# Altium project EPS.PrjPcb (part 3 of 4)

## Sheet EPS_MPPT_Y_OR_MPB.SchDoc: MPPT-Y / MPB ORing
size A4; ApprovedBy: (not approved); CheckedBy: (not checked); Author: Piotr Kuligowski; DocumentNumber: PWSat2-xxx-DW-xxx; Revision: 2; SheetNumber: 23; SheetTotal: 51; Model: EM2
Used 2 times, as channels Top/MPPT Y+/MPPTY ORing to MPB, Top/MPPT Y-/MPPTY ORing to MPB. Parts and nets are listed once, with the designators drawn on the sheet.
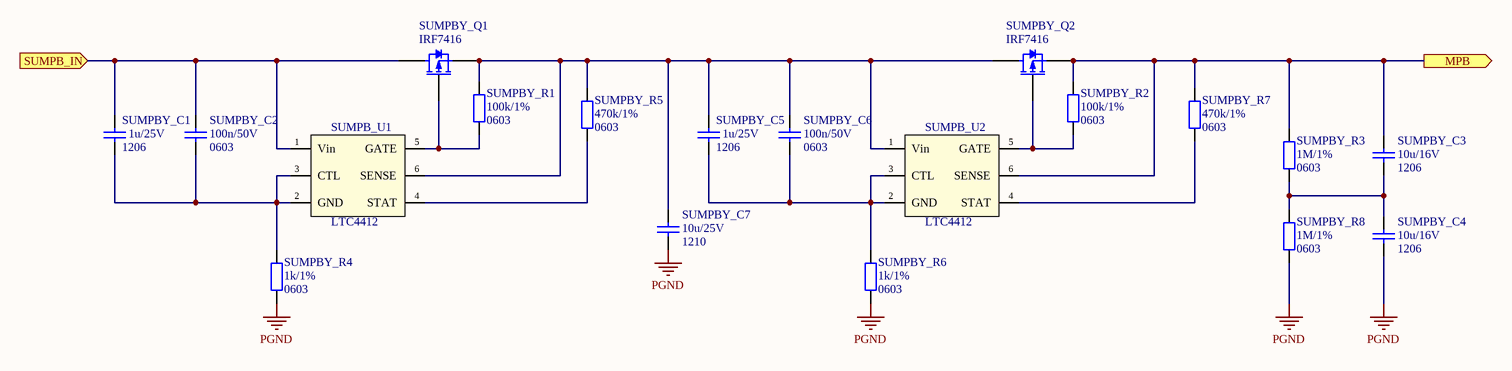
[diagram p23: EPS_MPPT_Y_OR_MPB.SchDoc]

### Parts
SUMPB_U1  LTC4412  [SOT23-6]
SUMPB_U2  LTC4412  [SOT23-6]
SUMPBY_C1  Package: 1206  [SMD_Capacitor_1206]  (hidden comment: 1u/25V)
SUMPBY_C2  Package: 0603  [SMD_Capacitor_0603]  (hidden comment: 100n/50V)
SUMPBY_C3  Packge: 1206  [SMD_Capacitor_1206]  (hidden comment: 10u/16V)
SUMPBY_C4  Packge: 1206  [SMD_Capacitor_1206]  (hidden comment: 10u/16V)
SUMPBY_C5  Package: 1206  [SMD_Capacitor_1206]  (hidden comment: 1u/25V)
SUMPBY_C6  Package: 0603  [SMD_Capacitor_0603]  (hidden comment: 100n/50V)
SUMPBY_C7  Package: 1210  [SMD_Capacitor_1210]  (hidden comment: 10u/25V)
SUMPBY_Q1  IRF7416  [SOIC-8-N_SSSGDDDD]
SUMPBY_Q2  IRF7416  [SOIC-8-N_SSSGDDDD]
SUMPBY_R1  Package: 0603  [SMD_Resistor_0603]  (hidden comment: 100k/1%)
SUMPBY_R2  Package: 0603  [SMD_Resistor_0603]  (hidden comment: 100k/1%)
SUMPBY_R3  Package: 0603  [SMD_Resistor_0603]  (hidden comment: 1M/1%)
SUMPBY_R4  Package: 0603  [SMD_Resistor_0603]  (hidden comment: 1k/1%)
SUMPBY_R5  Package: 0603  [SMD_Resistor_0603]  (hidden comment: 470k/1%)
SUMPBY_R6  Package: 0603  [SMD_Resistor_0603]  (hidden comment: 1k/1%)
SUMPBY_R7  Package: 0603  [SMD_Resistor_0603]  (hidden comment: 470k/1%)
SUMPBY_R8  Package: 0603  [SMD_Resistor_0603]  (hidden comment: 1M/1%)

### Ports
MPB (out), SUMPB_IN (in)

### Nets
PGND: SUMPBY_C4.2 SUMPBY_C7.2 SUMPBY_R4.2 SUMPBY_R6.2 SUMPBY_R8.2
MPB: SUMPB_U2.6(SENSE) SUMPBY_C3.1 SUMPBY_Q2.S SUMPBY_R2.1 SUMPBY_R3.1 SUMPBY_R7.1 ; port MPB
SUMPB_IN: SUMPB_U1.1(Vin) SUMPBY_C1.1 SUMPBY_C2.1 SUMPBY_Q1.D ; port SUMPB_IN
NetSUMPB_U1_2: SUMPB_U1.2(GND) SUMPB_U1.3(CTL) SUMPBY_C1.2 SUMPBY_C2.2 SUMPBY_R4.1
NetSUMPB_U1_4: SUMPB_U1.4(STAT) SUMPBY_R5.2
NetSUMPB_U1_5: SUMPB_U1.5(GATE) SUMPBY_Q1.G SUMPBY_R1.2
NetSUMPB_U1_6: SUMPB_U1.6(SENSE) SUMPB_U2.1(Vin) SUMPBY_C5.1 SUMPBY_C6.1 SUMPBY_C7.1 SUMPBY_Q1.S SUMPBY_Q2.D SUMPBY_R1.1 SUMPBY_R5.1
NetSUMPB_U2_2: SUMPB_U2.2(GND) SUMPB_U2.3(CTL) SUMPBY_C5.2 SUMPBY_C6.2 SUMPBY_R6.1
NetSUMPB_U2_4: SUMPB_U2.4(STAT) SUMPBY_R7.2
NetSUMPB_U2_5: SUMPB_U2.5(GATE) SUMPBY_Q2.G SUMPBY_R2.2
NetSUMPBY_C3_2: SUMPBY_C3.2 SUMPBY_C4.1 SUMPBY_R3.2 SUMPBY_R8.1

### Channels
Top/MPPT Y+/MPPTY ORing to MPB: designators end in _1; ports MPB=NetH3_2 SUMPB_IN=NetMPPT_R13_2_2
Top/MPPT Y-/MPPTY ORing to MPB: designators end in _2; ports MPB=NetH3_2 SUMPB_IN=NetMPPT_R13_3_2

### Notes on the sheet
- Title:
- Project:
- Author:
- Model:
- Document Number:
- Checked by:
- Rev:
- Date:
- Approved by:
- Sheet:
- of
- File name:

### Library data of the parts
SUMPB_U1 SUMPB_U2 = LTC4412: Ideal Diode, Low Loss PowerPath Controller.; Manufacturer: Linear Technology; Value: LTC4412
SUMPBY_C1 SUMPBY_C5 = Cer_C1206T105K3RALTU: Ceramic Cap Kemet COTS 1u/25V X7R 1206; ManufacturerPartNumber: C1206T105K3RALTU; Manufacturer: Kemet; Value: 1u/25V
SUMPBY_C2 SUMPBY_C6 = Cer_GCJ188R71H104KA12D: Ceramic Cap Murata Automotive 100n/50V X7R 0603; Manufacturer: Murata; ManufacturerPartNumber: GCJ188R71H104KA12D; Value: 100n/50V
SUMPBY_C3 SUMPBY_C4 = Cer_C1206T106K4RACTU: Ceramic Cap Kemet COTS 10u/16V X7R 1206; ManufacturerPartNumber: C1206T106K4RACTU; Manufacturer: Kemet; Value: 10u/16V
SUMPBY_C7 = Cer_GCJ32ER71E106KA12L: as DCDCX_C3-DCDCX_C6 on sheet EPS_MPPT_X_Boost-Converter; Manufacturer: Murata; ManufacturerPartNumber: GCJ32ER71E106KA12L; Value: 10u/25V
SUMPBY_Q1 SUMPBY_Q2 = IRF7416: as SUMPBX_Q1 on sheet EPS_MPPT_X_OR_MPB; Value: IRF7416
SUMPBY_R1-SUMPBY_R8 = Res
  SUMPBY_R1 SUMPBY_R2: Value: 100k/1%
  SUMPBY_R3 SUMPBY_R8: Value: 1M/1%
  SUMPBY_R4 SUMPBY_R6: Value: 1k/1%
  SUMPBY_R5 SUMPBY_R7: Value: 470k/1%

## Sheet EPS_RBL.SchDoc: Remove Before Launch
size A4; ApprovedBy: (not approved); CheckedBy: (not checked); Author: Piotr Kuligowski; DocumentNumber: PWSat2-xxx-DW-xxx; Revision: 2; SheetNumber: 32; SheetTotal: 51; Model: EM2
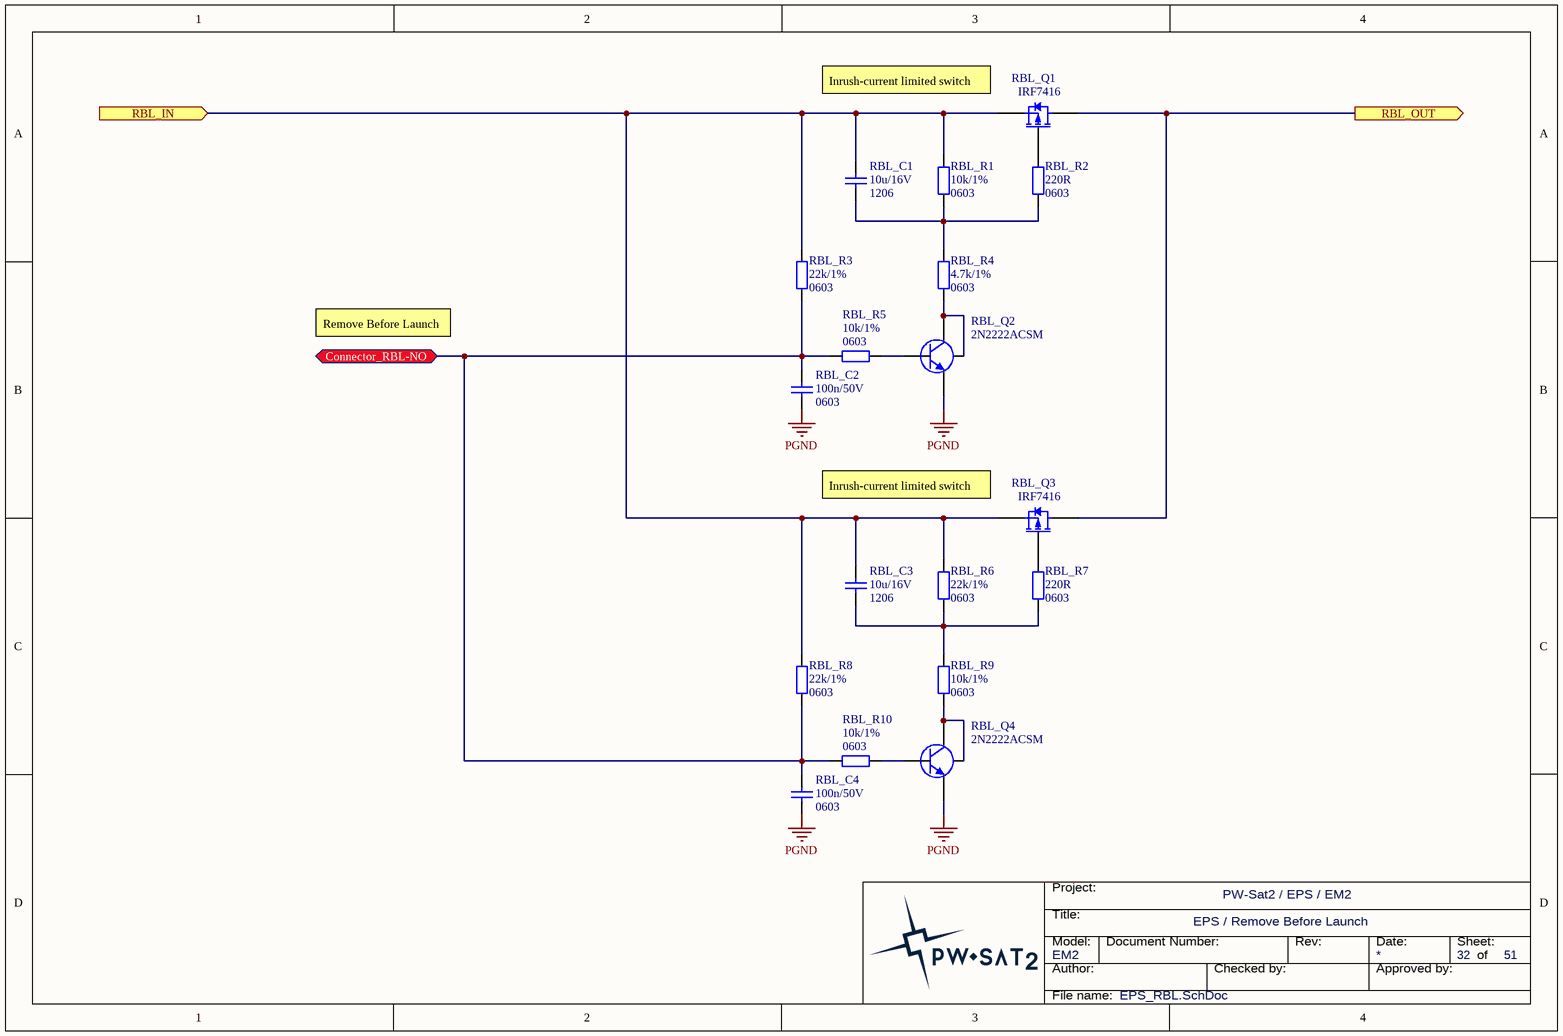
[diagram p24: EPS_RBL.SchDoc]

### Parts
RBL_C1  Packge: 1206  [SMD_Capacitor_1206]  (hidden comment: 10u/16V)
RBL_C2  Package: 0603  [SMD_Capacitor_0603]  (hidden comment: 100n/50V)
RBL_C3  Packge: 1206  [SMD_Capacitor_1206]  (hidden comment: 10u/16V)
RBL_C4  Package: 0603  [SMD_Capacitor_0603]  (hidden comment: 100n/50V)
RBL_Q1  IRF7416  [SOIC-8-N_SSSGDDDD]
RBL_Q2  2N2222ACSM  [LCC1-4_BEC]
RBL_Q3  IRF7416  [SOIC-8-N_SSSGDDDD]
RBL_Q4  2N2222ACSM  [LCC1-4_BEC]
RBL_R1  Package: 0603  [SMD_Resistor_0603]  (hidden comment: 10k/1%)
RBL_R2  Package: 0603  [SMD_Resistor_0603]  (hidden comment: 220R)
RBL_R3  Package: 0603  [SMD_Resistor_0603]  (hidden comment: 22k/1%)
RBL_R4  Package: 0603  [SMD_Resistor_0603]  (hidden comment: 4.7k/1%)
RBL_R5  Package: 0603  [SMD_Resistor_0603]  (hidden comment: 10k/1%)
RBL_R6  Package: 0603  [SMD_Resistor_0603]  (hidden comment: 22k/1%)
RBL_R7  Package: 0603  [SMD_Resistor_0603]  (hidden comment: 220R)
RBL_R8  Package: 0603  [SMD_Resistor_0603]  (hidden comment: 22k/1%)
RBL_R9  Package: 0603  [SMD_Resistor_0603]  (hidden comment: 10k/1%)
RBL_R10  Package: 0603  [SMD_Resistor_0603]  (hidden comment: 10k/1%)

### Ports
Connector_RBL-NO (bidir), RBL_IN (in), RBL_OUT (out)

### Nets
PGND: RBL_C2.2 RBL_C4.2 RBL_Q2.E RBL_Q4.E
NetDRLCL_C1_1_1: RBL_Q1.D RBL_Q3.D ; port RBL_OUT
NetH3_1: RBL_C1.1 RBL_C3.1 RBL_Q1.S RBL_Q3.S RBL_R1.1 RBL_R3.1 RBL_R6.1 RBL_R8.1 ; port RBL_IN
NetH5_2: RBL_C2.1 RBL_C4.1 RBL_R3.2 RBL_R5.1 RBL_R8.2 RBL_R10.1 ; port Connector_RBL-NO
NetRBL_C1_2: RBL_C1.2 RBL_R1.2 RBL_R2.2 RBL_R4.1
NetRBL_C3_2: RBL_C3.2 RBL_R6.2 RBL_R7.2 RBL_R9.1
NetRBL_Q1_G: RBL_Q1.G RBL_R2.1
NetRBL_Q2_B: RBL_Q2.B RBL_R5.2
NetRBL_Q2_C: RBL_Q2.C RBL_Q2.Shield RBL_R4.2
NetRBL_Q3_G: RBL_Q3.G RBL_R7.1
NetRBL_Q4_B: RBL_Q4.B RBL_R10.2
NetRBL_Q4_C: RBL_Q4.C RBL_Q4.Shield RBL_R9.2

### Notes on the sheet
- (near RBL_Q1) Inrush-current limited switch
- Remove Before Launch
- (near RBL_Q3) Inrush-current limited switch
- Title:
- Project:
- Author:
- Model:
- Document Number:
- Checked by:
- Rev:
- Date:
- Approved by:
- Sheet:
- of
- File name:

### Library data of the parts
RBL_C1 RBL_C3 = Cer_C1206T106K4RACTU: Ceramic Cap Kemet COTS 10u/16V X7R 1206; ManufacturerPartNumber: C1206T106K4RACTU; Manufacturer: Kemet; Value: 10u/16V
RBL_C2 RBL_C4 = Cer_GCJ188R71H104KA12D: as SUMPBY_C2 on sheet EPS_MPPT_Y_OR_MPB; Manufacturer: Murata; ManufacturerPartNumber: GCJ188R71H104KA12D; Value: 100n/50V
RBL_Q1 RBL_Q3 = IRF7416: as SUMPBX_Q1 on sheet EPS_MPPT_X_OR_MPB; Value: IRF7416
RBL_Q2 RBL_Q4 = 2N2222ACSM: Silicon Planar Epitaxial NPN Transistor.; Manufacturer: Semelab-TT; Value: 2N2222ACSM
RBL_R1-RBL_R10 = Res
  RBL_R1 RBL_R5 RBL_R9 RBL_R10: Value: 10k/1%
  RBL_R2 RBL_R7: Value: 220R
  RBL_R3 RBL_R6 RBL_R8: Value: 22k/1%
  RBL_R4: Value: 4.7k/1%

## Sheet EPS_DCDC_RLCLs.SchDoc: DCDC / RLCLs
size A4; ApprovedBy: (not approved); CheckedBy: (not checked); Author: Piotr Kuligowski; DocumentNumber: PWSat2-xxx-DW-xxx; Revision: 2; SheetNumber: 36; SheetTotal: 51; Model: EM2
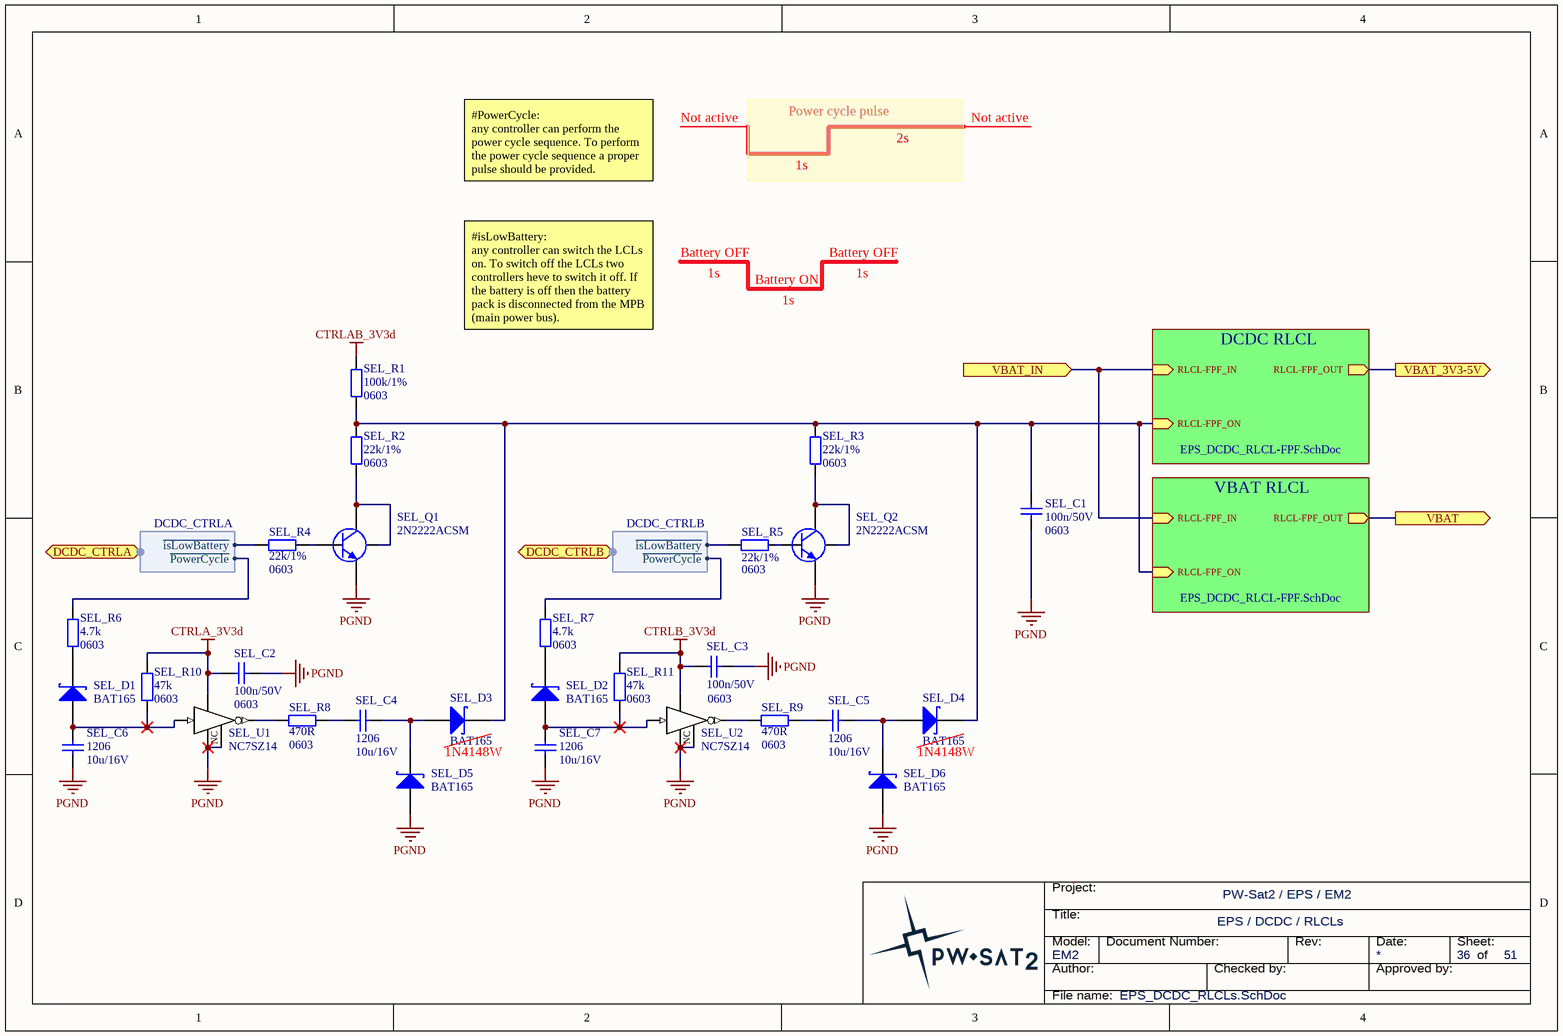
[diagram p25: EPS_DCDC_RLCLs.SchDoc]

### Parts
SEL_C1  value 100n/50V  Package: 0603  [SMD_Capacitor_0603]  (hidden comment: Cap)
SEL_C2  Package: 0603  [SMD_Capacitor_0603]  (hidden comment: 100n/50V)
SEL_C3  Package: 0603  [SMD_Capacitor_0603]  (hidden comment: 100n/50V)
SEL_C4  Packge: 1206  [SMD_Capacitor_1206]  (hidden comment: 10u/16V)
SEL_C5  Packge: 1206  [SMD_Capacitor_1206]  (hidden comment: 10u/16V)
SEL_C6  Packge: 1206  [SMD_Capacitor_1206]  (hidden comment: 10u/16V)
SEL_C7  Packge: 1206  [SMD_Capacitor_1206]  (hidden comment: 10u/16V)
SEL_D1  BAT165  [SOD323]
SEL_D2  BAT165  [SOD323]
SEL_D3  BAT165  [SOD323]
SEL_D4  BAT165  [SOD323]
SEL_D5  BAT165  [SOD323]
SEL_D6  BAT165  [SOD323]
SEL_Q1  2N2222ACSM  [LCC1-4_BEC]
SEL_Q2  2N2222ACSM  [LCC1-4_BEC]
SEL_R1  Package: 0603  [SMD_Resistor_0603]  (hidden comment: 100k/1%)
SEL_R2  Package: 0603  [SMD_Resistor_0603]  (hidden comment: 22k/1%)
SEL_R3  Package: 0603  [SMD_Resistor_0603]  (hidden comment: 22k/1%)
SEL_R4  Package: 0603  [SMD_Resistor_0603]  (hidden comment: 22k/1%)
SEL_R5  Package: 0603  [SMD_Resistor_0603]  (hidden comment: 22k/1%)
SEL_R6  Package: 0603  [SMD_Resistor_0603]  (hidden comment: 4.7k)
SEL_R7  Package: 0603  [SMD_Resistor_0603]  (hidden comment: 4.7k)
SEL_R8  Package: 0603  [SMD_Resistor_0603]  (hidden comment: 470R)
SEL_R9  Package: 0603  [SMD_Resistor_0603]  (hidden comment: 470R)
SEL_R10  Package: 0603  [SMD_Resistor_0603]  (hidden comment: 47k)
SEL_R11  Package: 0603  [SMD_Resistor_0603]  (hidden comment: 47k)
SEL_U1  NC7SZ14  [SOT23-5]
SEL_U2  NC7SZ14  [SOT23-5]

### Sub-sheets
DCDC RLCL = EPS_DCDC_RLCL-FPF.SchDoc: RLCL-FPF_IN (in), RLCL-FPF_OUT (out), RLCL-FPF_ON (in)
VBAT RLCL = EPS_DCDC_RLCL-FPF.SchDoc: RLCL-FPF_IN (in), RLCL-FPF_OUT (out), RLCL-FPF_ON (in)

### Ports
DCDC_CTRLA (harness DCDC_CTRLA), DCDC_CTRLB (harness DCDC_CTRLB), VBAT (out), VBAT_3V3-5V (out), VBAT_IN (in)

### Harnesses
DCDC_CTRLB: ~{PowerCycle}, ~{isLowBattery}
DCDC_CTRLA: ~{PowerCycle}, ~{isLowBattery}

### Nets
CTRLA_3V3d: SEL_C2.1 SEL_R10.2 SEL_U1.5(Vcc)
CTRLAB_3V3d: SEL_R1.2
CTRLB_3V3d: SEL_C3.1 SEL_R11.2 SEL_U2.5(Vcc)
PGND: SEL_C1.2 SEL_C2.2 SEL_C3.2 SEL_C6.1 SEL_C7.1 SEL_D5.A SEL_D6.A SEL_Q1.E SEL_Q2.E SEL_U1.1(NC) SEL_U1.3(GND) SEL_U2.1(NC) SEL_U2.3(GND)
NetCTRLA_U4_14: SEL_R4.1 ; port DCDC_CTRLA.~{isLowBattery}
NetCTRLA_U4_15: SEL_R6.2 ; port DCDC_CTRLA.~{PowerCycle}
NetCTRLB_U1_13: SEL_R5.1 ; port DCDC_CTRLB.~{isLowBattery}
NetCTRLB_U1_14: SEL_R7.2 ; port DCDC_CTRLB.~{PowerCycle}
NetDRLCL_C1_1_1: port VBAT_IN, sheet DCDC RLCL/RLCL-FPF_IN, sheet VBAT RLCL/RLCL-FPF_IN
NetDRLCL_C4_1_1: port VBAT_3V3-5V, sheet DCDC RLCL/RLCL-FPF_OUT
NetDRLCL_C4_2_1: port VBAT, sheet VBAT RLCL/RLCL-FPF_OUT
NetDRLCL_U1_1_4: SEL_C1.1 SEL_D3.K SEL_D4.K SEL_R1.1 SEL_R2.2 SEL_R3.2 ; sheet DCDC RLCL/RLCL-FPF_ON, sheet VBAT RLCL/RLCL-FPF_ON
NetSEL_C4_1: SEL_C4.1 SEL_R8.2
NetSEL_C4_2: SEL_C4.2 SEL_D3.A SEL_D5.K
NetSEL_C5_1: SEL_C5.1 SEL_R9.2
NetSEL_C5_2: SEL_C5.2 SEL_D4.A SEL_D6.K
NetSEL_C6_2: SEL_C6.2 SEL_D1.A SEL_R10.1 SEL_U1.2(A)
NetSEL_C7_2: SEL_C7.2 SEL_D2.A SEL_R11.1 SEL_U2.2(A)
NetSEL_D1_K: SEL_D1.K SEL_R6.1
NetSEL_D2_K: SEL_D2.K SEL_R7.1
NetSEL_Q1_B: SEL_Q1.B SEL_R4.2
NetSEL_Q1_C: SEL_Q1.C SEL_Q1.Shield SEL_R2.1
NetSEL_Q2_B: SEL_Q2.B SEL_R5.2
NetSEL_Q2_C: SEL_Q2.C SEL_Q2.Shield SEL_R3.1
NetSEL_R8_1: SEL_R8.1 SEL_U1.4(Y)
NetSEL_R9_1: SEL_R9.1 SEL_U2.4(Y)

### Notes on the sheet
- Power cycle pulse
- #PowerCycle:
  any controller can perform the power cycle sequence. To perform the power cycle sequence a proper pulse should be provided.
- Not active
- 1s
- 2s
- Battery OFF
- Battery ON
- #isLowBattery:
  any controller can switch the LCLs on. To switch off the LCLs two controllers heve to switch it off. If the battery is off then the battery pack is disconnected from the MPB (main power bus).
- 1N4148W
- Title:
- Project:
- Author:
- Model:
- Document Number:
- Checked by:
- Rev:
- Date:
- Approved by:
- Sheet:
- of
- File name:

### Library data of the parts
SEL_C2 SEL_C3 = Cer_C0603T104K5RALTU: Ceramic Cap Kemet COTS 100n/50V X7R 0603; Manufacturer: Kemet; ManufacturerPartNumber: C0603T104K5RALTU; Value: 100n/50V
SEL_C4-SEL_C7 = Cer_C1206T106K4RACTU: Ceramic Cap Kemet COTS 10u/16V X7R 1206; ManufacturerPartNumber: C1206T106K4RACTU; Manufacturer: Kemet; Value: 10u/16V
SEL_D1-SEL_D6 = BAT165: Madium Power AF Schottky 750mA 40V Diode; Manufacturer: Infineon; Value: BAT165
SEL_Q1 SEL_Q2 = 2N2222ACSM: as RBL_Q2 on sheet EPS_RBL; Value: 2N2222ACSM
SEL_R1-SEL_R11 = Res
  SEL_R1: Value: 100k/1%
  SEL_R2-SEL_R5: Value: 22k/1%
  SEL_R6 SEL_R7: Value: 4.7k
  SEL_R8 SEL_R9: Value: 470R
  SEL_R10 SEL_R11: Value: 47k
SEL_U1 SEL_U2 = NC7SZ14: TinyLogic UHS TinyLogic UHS Two-Input NAND Gate.; Manufacturer: Fairchild Semiconductor; Value: NC7SZ14

## Sheet EPS_DCDC_RLCL-FPF.SchDoc: DCDC / RLCL-FPF
size A4; ApprovedBy: (not approved); CheckedBy: (not checked); Author: Piotr Kuligowski; DocumentNumber: PWSat2-xxx-DW-xxx; Revision: 2; SheetNumber: 35; SheetTotal: 51; Model: EM2
Used 2 times, as channels Top/LCLs for DCDC/DCDC RLCL, Top/LCLs for DCDC/VBAT RLCL. Parts and nets are listed once, with the designators drawn on the sheet.
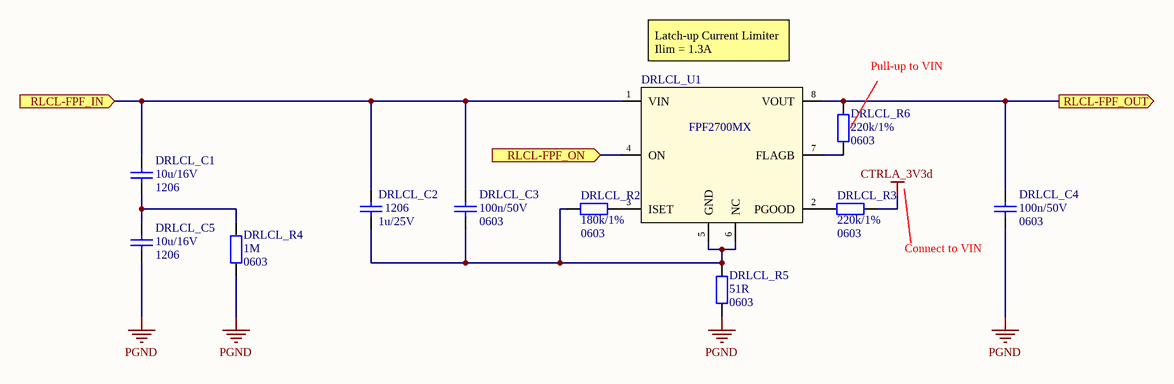
[diagram p26: EPS_DCDC_RLCL-FPF.SchDoc]

### Parts
DRLCL_C1  Packge: 1206  [SMD_Capacitor_1206]  (hidden comment: 10u/16V)
DRLCL_C2  Package: 1206  [SMD_Capacitor_1206]  (hidden comment: 1u/25V)
DRLCL_C3  Package: 0603  [SMD_Capacitor_0603]  (hidden comment: 100n/50V)
DRLCL_C4  Package: 0603  [SMD_Capacitor_0603]  (hidden comment: 100n/50V)
DRLCL_C5  Packge: 1206  [SMD_Capacitor_1206]  (hidden comment: 10u/16V)
DRLCL_R2  Package: 0603  [SMD_Resistor_0603]  (hidden comment: 180k/1%)
DRLCL_R3  Package: 0603  [SMD_Resistor_0603]  (hidden comment: 220k/1%)
DRLCL_R4  Package: 0603  [SMD_Resistor_0603]  (hidden comment: 1M)
DRLCL_R5  Package: 0603  [SMD_Resistor_0603]  (hidden comment: 51R)
DRLCL_R6  Package: 0603  [SMD_Resistor_0603]  (hidden comment: 220k/1%)
DRLCL_U1  FPF2700MX  [SOIC-8-N]

### Ports
RLCL-FPF_IN (in), RLCL-FPF_ON (in), RLCL-FPF_OUT (out)

### Nets
CTRLA_3V3d: DRLCL_R3.2
PGND: DRLCL_C4.2 DRLCL_C5.2 DRLCL_R4.1 DRLCL_R5.2
RLCL-FPF_IN: DRLCL_C1.1 DRLCL_C2.1 DRLCL_C3.1 DRLCL_U1.1(VIN) ; port RLCL-FPF_IN
RLCL-FPF_ON: DRLCL_U1.4(ON) ; port RLCL-FPF_ON
RLCL-FPF_OUT: DRLCL_C4.1 DRLCL_R6.2 DRLCL_U1.8(VOUT) ; port RLCL-FPF_OUT
NetDRLCL_C1_2: DRLCL_C1.2 DRLCL_C5.1 DRLCL_R4.2
NetDRLCL_C2_2: DRLCL_C2.2 DRLCL_C3.2 DRLCL_R2.1 DRLCL_R5.1 DRLCL_U1.5(GND) DRLCL_U1.6(NC)
NetDRLCL_R2_2: DRLCL_R2.2 DRLCL_U1.3(ISET)
NetDRLCL_R3_1: DRLCL_R3.1 DRLCL_U1.2(PGOOD)
NetDRLCL_R6_1: DRLCL_R6.1 DRLCL_U1.7(FLAGB)

### Channels
Top/LCLs for DCDC/DCDC RLCL: designators end in _1; ports RLCL-FPF_IN=NetDRLCL_C1_1_1 RLCL-FPF_ON=NetDRLCL_U1_1_4 RLCL-FPF_OUT=NetDRLCL_C4_1_1
Top/LCLs for DCDC/VBAT RLCL: designators end in _2; ports RLCL-FPF_IN=NetDRLCL_C1_1_1 RLCL-FPF_ON=NetDRLCL_U1_1_4 RLCL-FPF_OUT=NetDRLCL_C4_2_1

### Notes on the sheet
- (near DRLCL_U1) Latch-up Current Limiter
  Ilim = 1.3A
- Pull-up to VIN
- (near DRLCL_C4) Connect to VIN
- Title:
- Project:
- Author:
- Model:
- Document Number:
- Checked by:
- Rev:
- Date:
- Approved by:
- Sheet:
- of
- File name:

### Library data of the parts
DRLCL_C1 DRLCL_C5 = Cer_C1206T106K4RACTU: Ceramic Cap Kemet COTS 10u/16V X7R 1206; ManufacturerPartNumber: C1206T106K4RACTU; Manufacturer: Kemet; Value: 10u/16V
DRLCL_C2 = Cer_C1206T105K3RALTU: Ceramic Cap Kemet COTS 1u/25V X7R 1206; ManufacturerPartNumber: C1206T105K3RALTU; Manufacturer: Kemet; Value: 1u/25V
DRLCL_C3 DRLCL_C4 = Cer_GCJ188R71H104KA12D: as SUMPBY_C2 on sheet EPS_MPPT_Y_OR_MPB; Manufacturer: Murata; ManufacturerPartNumber: GCJ188R71H104KA12D; Value: 100n/50V
DRLCL_R2-DRLCL_R6 = Res
  DRLCL_R2: Value: 180k/1%
  DRLCL_R3 DRLCL_R6: Value: 220k/1%
  DRLCL_R4: Value: 1M
  DRLCL_R5: Value: 51R
DRLCL_U1 = FPF2700MX: Adj over-current protection 0.4-2A, Load Switch; Manufacturer: Fairchild Semiconductor; Value: FPF2700MX

## Sheet EPS_Local-Supply.SchDoc: Local Supply
size A4; ApprovedBy: (not approved); CheckedBy: (not checked); Author: Piotr Kuligowski; DocumentNumber: PWSat2-xxx-DW-xxx; Revision: 2; SheetNumber: 33; SheetTotal: 51; Model: EM2
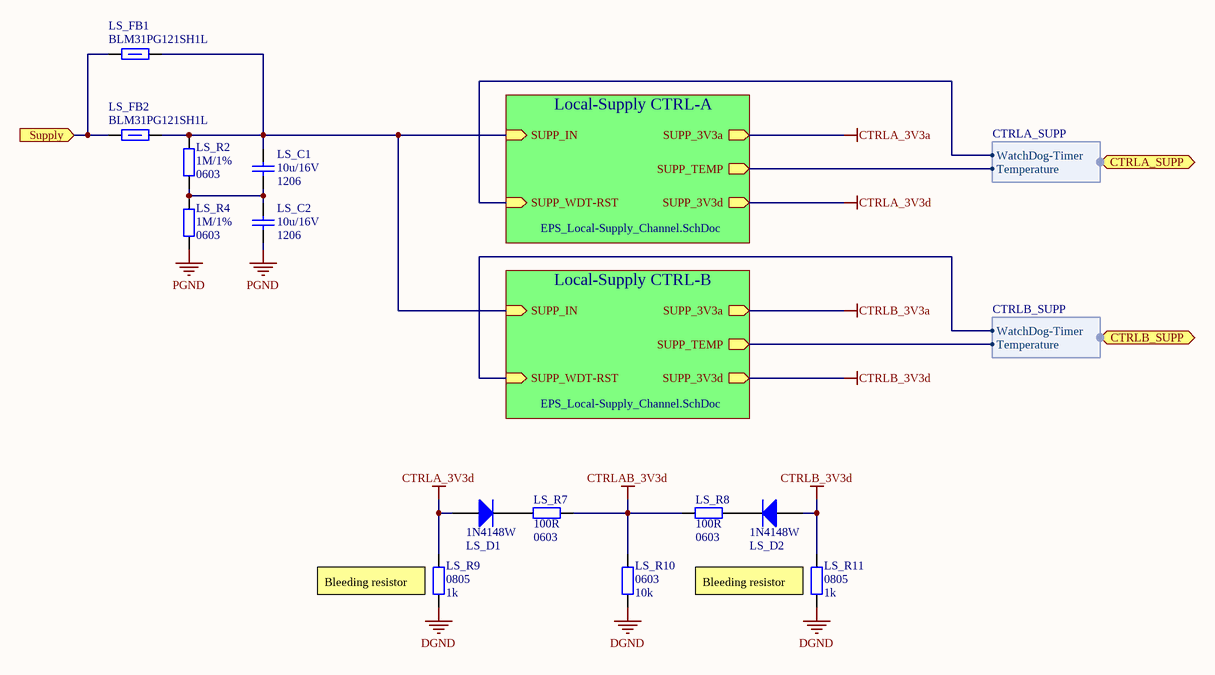
[diagram p27: EPS_Local-Supply.SchDoc]

### Parts
LS_C1  Packge: 1206  [SMD_Capacitor_1206]  (hidden comment: 10u/16V)
LS_C2  Packge: 1206  [SMD_Capacitor_1206]  (hidden comment: 10u/16V)
LS_D1  1N4148W  [SOD-123]
LS_D2  1N4148W  [SOD-123]
LS_FB1  120R/100MHz  [SMD_FerriteBead_1206]  (value not drawn)
LS_FB2  120R/100MHz  [SMD_FerriteBead_1206]  (value not drawn)
LS_R2  Package: 0603  [SMD_Resistor_0603]  (hidden comment: 1M/1%)
LS_R4  Package: 0603  [SMD_Resistor_0603]  (hidden comment: 1M/1%)
LS_R7  Package: 0603  [SMD_Resistor_0603]  (hidden comment: 100R)
LS_R8  Package: 0603  [SMD_Resistor_0603]  (hidden comment: 100R)
LS_R9  Package: 0805  [SMD_Resistor_0805]  (hidden comment: 1k)
LS_R10  Package: 0603  [SMD_Resistor_0603]  (hidden comment: 10k)
LS_R11  Package: 0805  [SMD_Resistor_0805]  (hidden comment: 1k)

### Sub-sheets
Local-Supply CTRL-A = EPS_Local-Supply_Channel.SchDoc: SUPP_IN (in), SUPP_3V3d (out), SUPP_3V3a (out), SUPP_WDT-RST (in), SUPP_TEMP (out)
Local-Supply CTRL-B = EPS_Local-Supply_Channel.SchDoc: SUPP_IN (in), SUPP_3V3d (out), SUPP_3V3a (out), SUPP_WDT-RST (in), SUPP_TEMP (out)

### Ports
CTRLA_SUPP (harness CTRLA_SUPP), CTRLB_SUPP (harness CTRLB_SUPP), Supply (in)

### Harnesses
CTRLA_SUPP: Temperature, WatchDog-Timer
CTRLB_SUPP: Temperature, WatchDog-Timer

### Nets
CTRLA_3V3d: LS_D1.A LS_R9.2 ; sheet Local-Supply CTRL-A/SUPP_3V3d
CTRLAB_3V3d: LS_R7.2 LS_R8.1 LS_R10.2
CTRLB_3V3d: LS_D2.A LS_R11.2 ; sheet Local-Supply CTRL-B/SUPP_3V3d
DGND: LS_R9.1 LS_R10.1 LS_R11.1
PGND: LS_C2.2 LS_R4.2
CTRLA_HK_SUPP_TEMP: sheet Local-Supply CTRL-A/SUPP_TEMP, port CTRLA_SUPP.Temperature
CTRLB_HK_SUPP_TEMP: sheet Local-Supply CTRL-B/SUPP_TEMP, port CTRLB_SUPP.Temperature
NetCTRLA_U4_17: sheet Local-Supply CTRL-A/SUPP_WDT-RST, port CTRLA_SUPP.WatchDog-Timer
NetCTRLB_U1_42: sheet Local-Supply CTRL-B/SUPP_WDT-RST, port CTRLB_SUPP.WatchDog-Timer
NetDRLCL_C1_1_1: LS_FB1.1 LS_FB2.1 ; port Supply
NetLS_C1_1: LS_C1.1 LS_FB1.2 LS_FB2.2 LS_R2.1 ; sheet Local-Supply CTRL-A/SUPP_IN, sheet Local-Supply CTRL-B/SUPP_IN
NetLS_C1_2: LS_C1.2 LS_C2.1 LS_R2.2 LS_R4.1
NetLS_D1_K: LS_D1.K LS_R7.1
NetLS_D2_K: LS_D2.K LS_R8.2

### Notes on the sheet
- (near LS_R9) Bleeding resistor
- (near LS_R11) Bleeding resistor
- Title:
- Project:
- Author:
- Model:
- Document Number:
- Checked by:
- Rev:
- Date:
- Approved by:
- Sheet:
- of
- File name:

### Library data of the parts
LS_C1 LS_C2 = Cer_C1206T106K4RACTU: Ceramic Cap Kemet COTS 10u/16V X7R 1206; ManufacturerPartNumber: C1206T106K4RACTU; Manufacturer: Kemet; Value: 10u/16V
LS_D1 LS_D2 = 1N4148W: Small Signal Fast Switching Diode; Manufacturer: Vishay; Value: 1N4148W
LS_FB1 LS_FB2 = BLM31PG121SH1L: as EMIXS_FB1-EMIXS_FB3 on sheet EPS_MPPT_X_EMI-Filter_Solar-Panels; Package: 1206; Value: 120R/100MHz; ManufacturerPartNumber: BLM31PG121SH1L
LS_R2 LS_R4 LS_R7-LS_R11 = Res
  LS_R2 LS_R4: Value: 1M/1%
  LS_R7 LS_R8: Value: 100R
  LS_R9 LS_R11: Value: 1k
  LS_R10: Value: 10k

## Sheet EPS_Local-Supply_Channel.SchDoc: Local Supply / Channel
size A3; ApprovedBy: (not approved); CheckedBy: (not checked); Author: Piotr Kuligowski; DocumentNumber: PWSat2-xxx-DW-xxx; Revision: 2; SheetNumber: 34; SheetTotal: 51; Model: EM2
Used 2 times, as channels Top/Local-Supply and WDTs/Local-Supply CTRL-A, Top/Local-Supply and WDTs/Local-Supply CTRL-B. Parts and nets are listed once, with the designators drawn on the sheet.
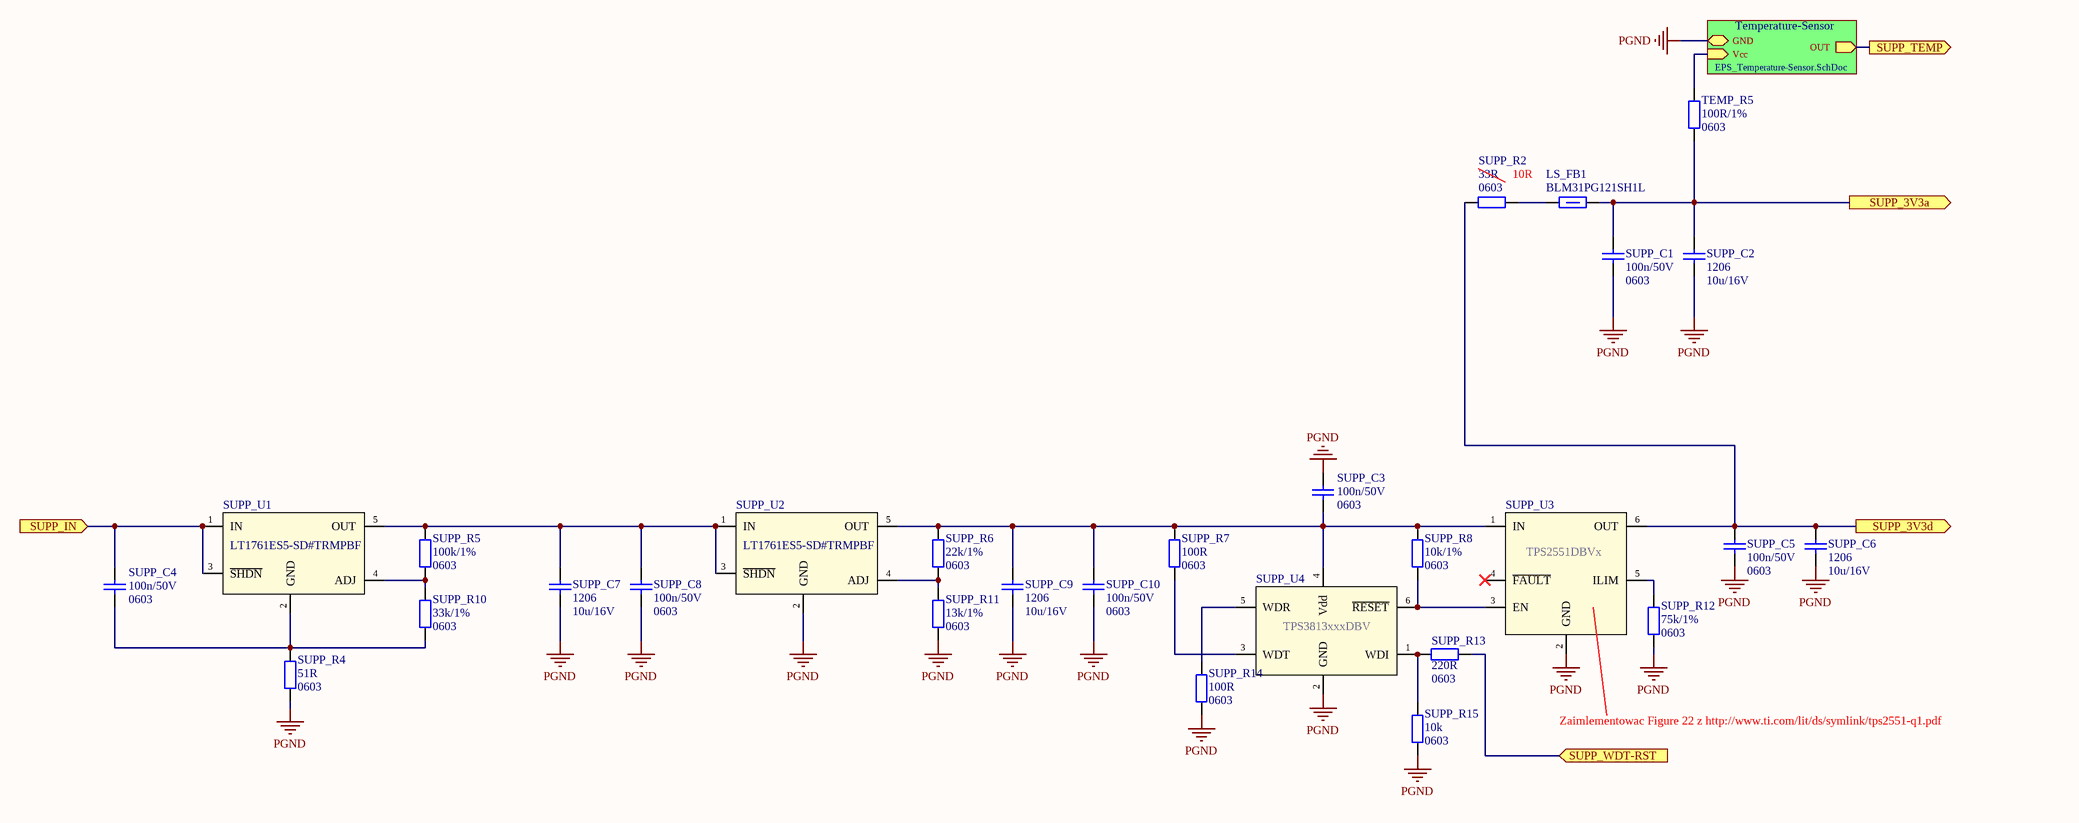
[diagram p28: EPS_Local-Supply_Channel.SchDoc]

### Parts
LS_FB1  120R/100MHz  [SMD_FerriteBead_1206]  (value not drawn)
SUPP_C1  Package: 0603  [SMD_Capacitor_0603]  (hidden comment: 100n/50V)
SUPP_C2  Packge: 1206  [SMD_Capacitor_1206]  (hidden comment: 10u/16V)
SUPP_C3  Package: 0603  [SMD_Capacitor_0603]  (hidden comment: 100n/50V)
SUPP_C4  Package: 0603  [SMD_Capacitor_0603]  (hidden comment: 100n/50V)
SUPP_C5  Package: 0603  [SMD_Capacitor_0603]  (hidden comment: 100n/50V)
SUPP_C6  Packge: 1206  [SMD_Capacitor_1206]  (hidden comment: 10u/16V)
SUPP_C7  Packge: 1206  [SMD_Capacitor_1206]  (hidden comment: 10u/16V)
SUPP_C8  Package: 0603  [SMD_Capacitor_0603]  (hidden comment: 100n/50V)
SUPP_C9  Packge: 1206  [SMD_Capacitor_1206]  (hidden comment: 10u/16V)
SUPP_C10  Package: 0603  [SMD_Capacitor_0603]  (hidden comment: 100n/50V)
SUPP_R2  Package: 0603  [SMD_Resistor_0603]  (hidden comment: 33R)
SUPP_R4  Package: 0603  [SMD_Resistor_0603]  (hidden comment: 51R)
SUPP_R5  Package: 0603  [SMD_Resistor_0603]  (hidden comment: 100k/1%)
SUPP_R6  Package: 0603  [SMD_Resistor_0603]  (hidden comment: 22k/1%)
SUPP_R7  Package: 0603  [SMD_Resistor_0603]  (hidden comment: 100R)
SUPP_R8  Package: 0603  [SMD_Resistor_0603]  (hidden comment: 10k/1%)
SUPP_R10  Package: 0603  [SMD_Resistor_0603]  (hidden comment: 33k/1%)
SUPP_R11  Package: 0603  [SMD_Resistor_0603]  (hidden comment: 13k/1%)
SUPP_R12  Package: 0603  [SMD_Resistor_0603]  (hidden comment: 75k/1%)
SUPP_R13  Package: 0603  [SMD_Resistor_0603]  (hidden comment: 220R)
SUPP_R14  Package: 0603  [SMD_Resistor_0603]  (hidden comment: 100R)
SUPP_R15  Package: 0603  [SMD_Resistor_0603]  (hidden comment: 10k)
SUPP_U1  LT1761ES5-SD#TRMPBF  [SOT23-5]
SUPP_U2  LT1761ES5-SD#TRMPBF  [SOT23-5]
SUPP_U3  TPS2551DBVx  [SOT23-6]
SUPP_U4  TPS3813xxxDBV  [SOT23-6]
TEMP_R5  Package: 0603  [SMD_Resistor_0603]  (hidden comment: 100R/1%)

### Sub-sheets
Temperature-Sensor = EPS_Temperature-Sensor.SchDoc: OUT (out), Vcc (in), GND

### Ports
SUPP_3V3a (out), SUPP_3V3d (out), SUPP_IN (in), SUPP_TEMP (out), SUPP_WDT-RST (in)

### Nets
PGND: SUPP_C1.2 SUPP_C2.2 SUPP_C3.1 SUPP_C5.2 SUPP_C6.2 SUPP_C7.2 SUPP_C8.2 SUPP_C9.2 SUPP_C10.2 SUPP_R4.2 SUPP_R11.2 SUPP_R12.2 SUPP_R14.2 SUPP_R15.1 SUPP_U2.2(GND) SUPP_U3.2(GND) SUPP_U4.2(GND) ; sheet Temperature-Sensor/GND
SUPP_3V3a: LS_FB1.2 SUPP_C1.1 SUPP_C2.1 TEMP_R5.2 ; port SUPP_3V3a
SUPP_3V3d: SUPP_C5.1 SUPP_C6.1 SUPP_R2.1 SUPP_U3.6(OUT) ; port SUPP_3V3d
SUPP_IN: SUPP_C4.1 SUPP_U1.1(IN) SUPP_U1.3(~{SHDN}) ; port SUPP_IN
SUPP_TEMP: port SUPP_TEMP, sheet Temperature-Sensor/OUT
SUPP_WDT-RST: SUPP_R13.2 ; port SUPP_WDT-RST
NetLS_FB1_1: LS_FB1.1 SUPP_R2.2
NetSUPP_C3_2: SUPP_C3.2 SUPP_C9.1 SUPP_C10.1 SUPP_R6.1 SUPP_R7.1 SUPP_R8.1 SUPP_U2.5(OUT) SUPP_U3.1(IN) SUPP_U4.4(Vdd)
NetSUPP_C4_2: SUPP_C4.2 SUPP_R4.1 SUPP_R10.2 SUPP_U1.2(GND)
NetSUPP_C7_1: SUPP_C7.1 SUPP_C8.1 SUPP_R5.1 SUPP_U1.5(OUT) SUPP_U2.1(IN) SUPP_U2.3(~{SHDN})
NetSUPP_R5_2: SUPP_R5.2 SUPP_R10.1 SUPP_U1.4(ADJ)
NetSUPP_R6_2: SUPP_R6.2 SUPP_R11.1 SUPP_U2.4(ADJ)
NetSUPP_R7_2: SUPP_R7.2 SUPP_U4.3(WDT)
NetSUPP_R8_2: SUPP_R8.2 SUPP_U3.3(EN) SUPP_U4.6(~{RESET})
NetSUPP_R12_1: SUPP_R12.1 SUPP_U3.5(ILIM)
NetSUPP_R13_1: SUPP_R13.1 SUPP_R15.2 SUPP_U4.1(WDI)
NetSUPP_R14_1: SUPP_R14.1 SUPP_U4.5(WDR)
NetTEMP_R5_1: TEMP_R5.1 ; sheet Temperature-Sensor/Vcc

Not connected (* = marked no-connect by the designer): SUPP_U3 4(~{FAULT})*

### Channels
Top/Local-Supply and WDTs/Local-Supply CTRL-A: designators end in _1; ports SUPP_3V3a=CTRLA_3V3a SUPP_3V3d=CTRLA_3V3d SUPP_IN=NetLS_C1_1 SUPP_TEMP=CTRLA_HK_SUPP_TEMP SUPP_WDT-RST=NetCTRLA_U4_17
Top/Local-Supply and WDTs/Local-Supply CTRL-B: designators end in _2; ports SUPP_3V3a=CTRLB_3V3a SUPP_3V3d=CTRLB_3V3d SUPP_IN=NetLS_C1_1 SUPP_TEMP=CTRLB_HK_SUPP_TEMP SUPP_WDT-RST=NetCTRLB_U1_42

### Notes on the sheet
- 10R
- Zaimlementowac Figure 22 z http://www.ti.com/lit/ds/symlink/tps2551-q1.pdf
- Title:
- Project:
- Author:
- Model:
- Document Number:
- Checked by:
- Rev:
- Date:
- Approved by:
- Sheet:
- of
- File name:

### Library data of the parts
LS_FB1 = BLM31PG121SH1L: Ferrite bead, 1206, 0.02HM, 3.5A.; Manufacturer: Murata; Current Rating: 3.5A; Series Resistance DC: 0.02R; Package: 1206; Value: 120R/100MHz; ManufacturerPartNumber: BLM31PG121SH1L
SUPP_C1 SUPP_C3-SUPP_C5 SUPP_C8 SUPP_C10 = Cer_C0603T104K5RALTU: Ceramic Cap Kemet COTS 100n/50V X7R 0603; Manufacturer: Kemet; ManufacturerPartNumber: C0603T104K5RALTU; Value: 100n/50V
SUPP_C2 SUPP_C6 SUPP_C7 SUPP_C9 = Cer_C1206T106K4RACTU: Ceramic Cap Kemet COTS 10u/16V X7R 1206; ManufacturerPartNumber: C1206T106K4RACTU; Manufacturer: Kemet; Value: 10u/16V
SUPP_R2 SUPP_R4-SUPP_R8 SUPP_R10-SUPP_R15 = Res
  SUPP_R2: Value: 33R
  SUPP_R4: Value: 51R
  SUPP_R5: Value: 100k/1%
  SUPP_R6: Value: 22k/1%
  SUPP_R7 SUPP_R14: Value: 100R
  SUPP_R8: Value: 10k/1%
  SUPP_R10: Value: 33k/1%
  SUPP_R11: Value: 13k/1%
  SUPP_R12: Value: 75k/1%
  SUPP_R13: Value: 220R
  SUPP_R15: Value: 10k
SUPP_U1 SUPP_U2 = LT1761ES5-SD#TRMPBF: 100mA, Regulated, Low Noise, LDO Micropower Regulator in TSOT-23; Manufacturer: Linear Technology; Value: LT1761ES5-SD#TRMPBF
SUPP_U3 = TPS2551DBVx: Adjustable Current-Limited Power-Distribution Switch.; Manufacturer: Texas Instruments; Value: TPS2551DBVx
SUPP_U4 = TPS3813xxxDBV: Processor Supervisory Circuits with Window-Watchdog.; Manufacturer: Texas Instruments; Value: TPS3813xxxDBV
TEMP_R5 = CRCW06031K00FKxxxx: 1k/1% Vishay CRCW 0603 Resistor. 100mW, 100ppm, 75V.; Manufacturer: Vishay; ManufacturerPartNumber: CRCW06031K00FKxxxx; Value: 100R/1%

## Sheet EPS_CTRL_B.SchDoc: CTRL-B
size A3; ApprovedBy: (not approved); CheckedBy: (not checked); Author: Piotr Kuligowski; DocumentNumber: PWSat2-xxx-DW-xxx; Revision: 2; SheetNumber: 24; SheetTotal: 51; Model: EM2
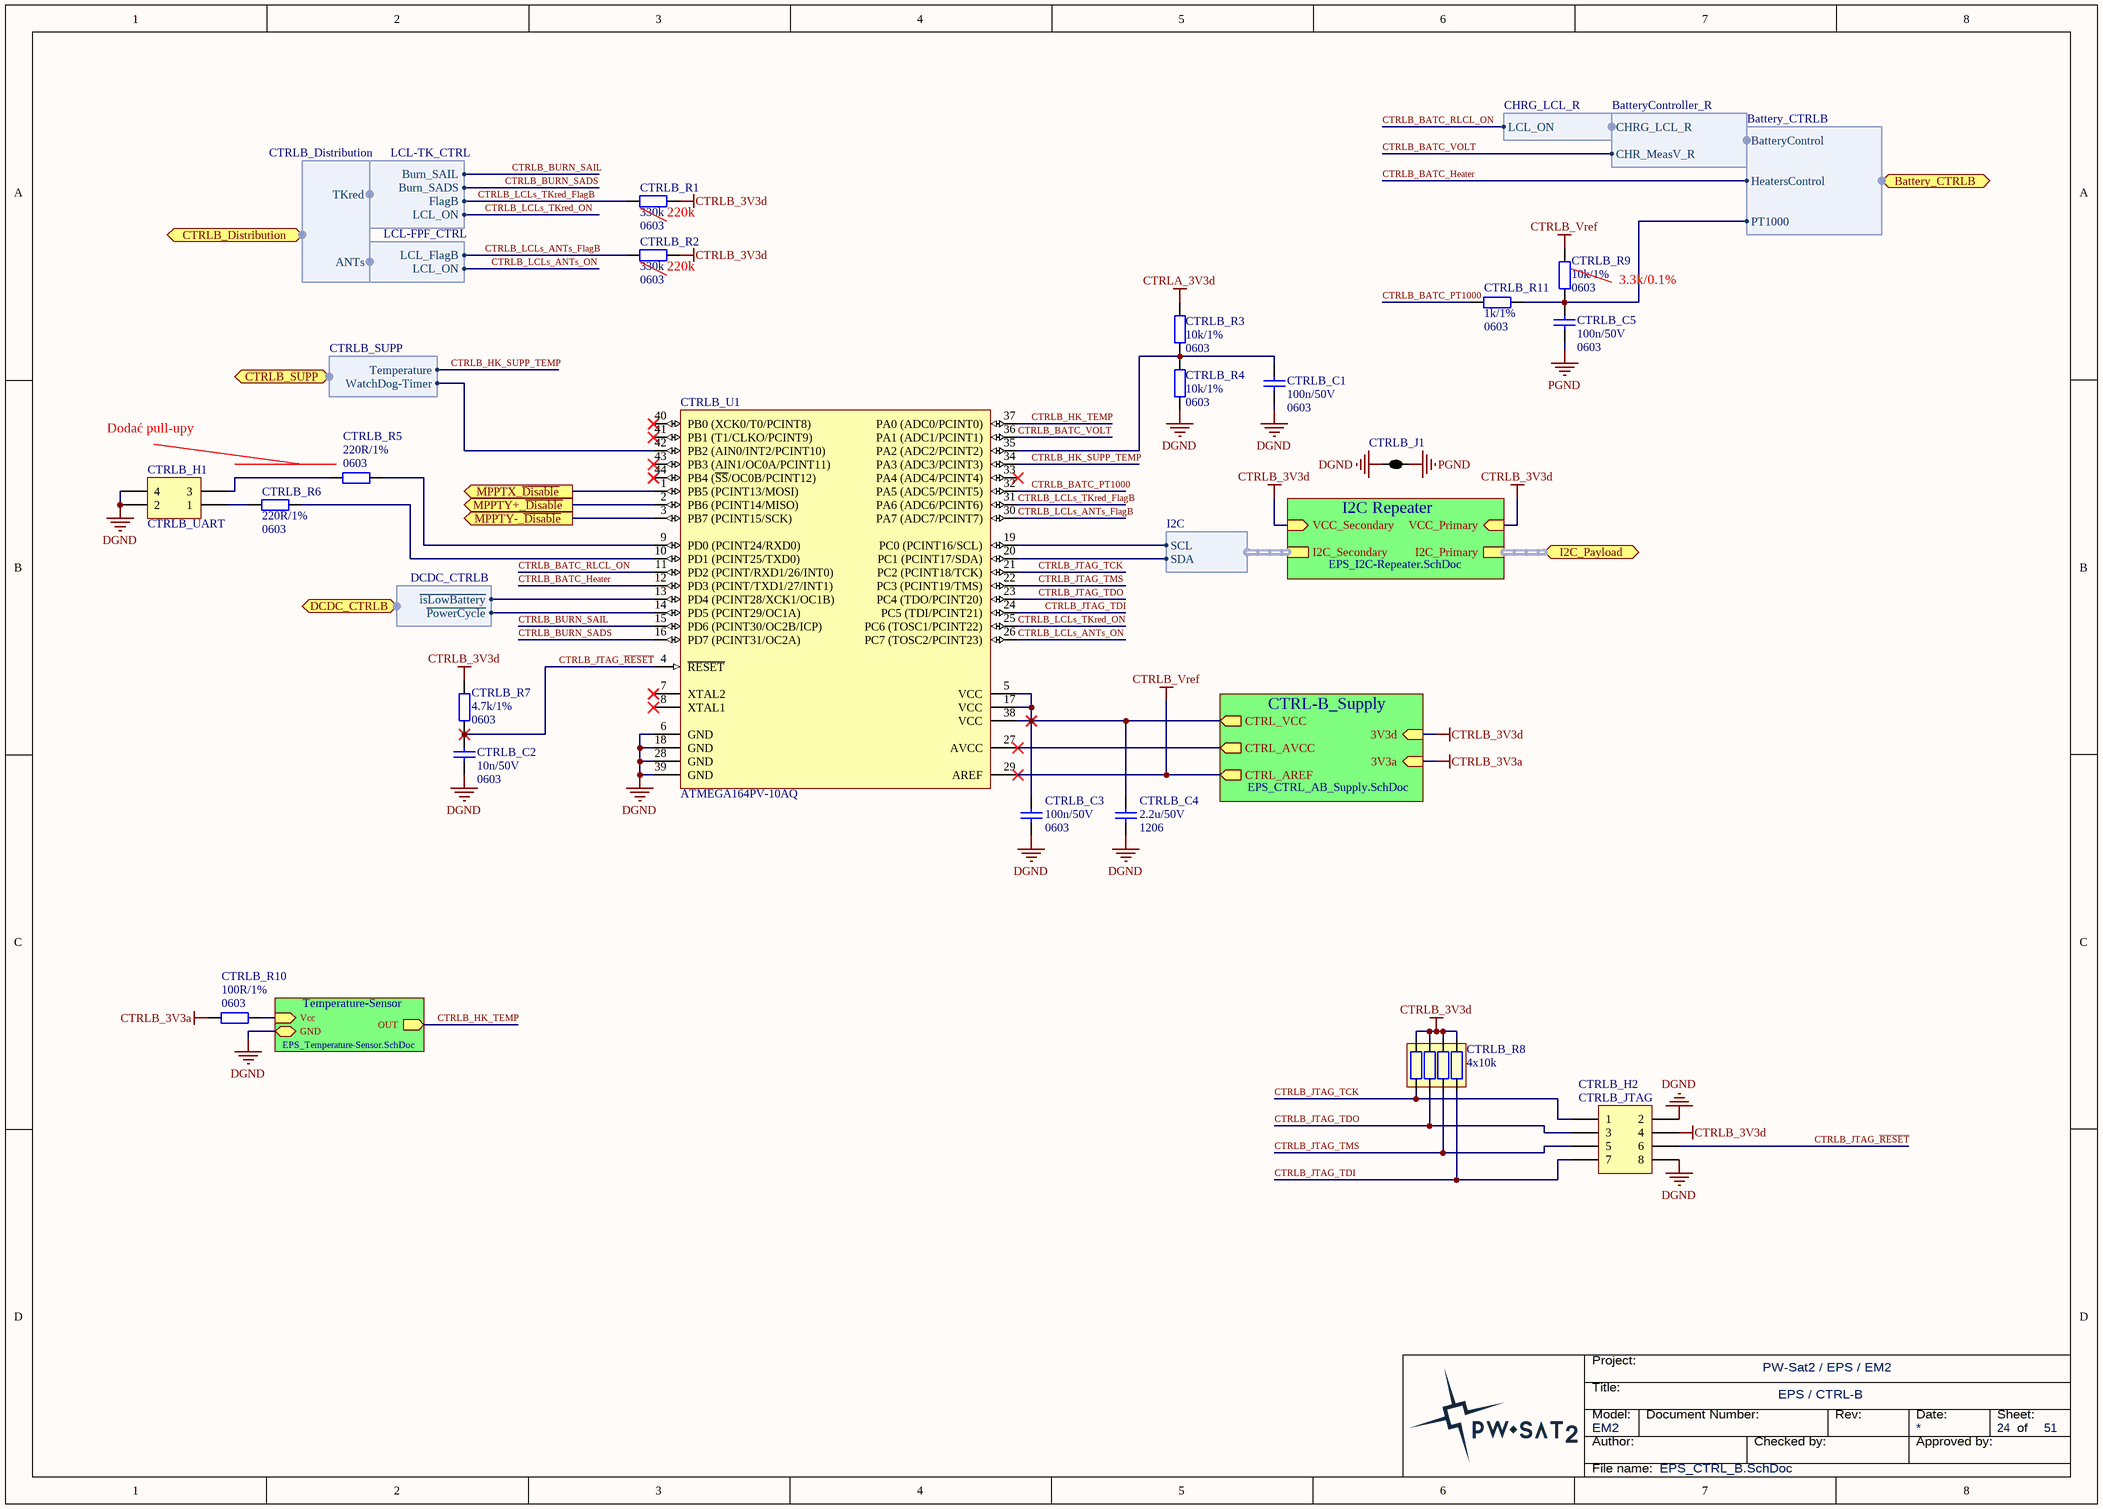
[diagram p29: EPS_CTRL_B.SchDoc]

### Parts
CTRLB_C1  Package: 0603  [SMD_Capacitor_0603]  (hidden comment: 100n/50V)
CTRLB_C2  Package: 0603  [SMD_Capacitor_0603]  (hidden comment: 10n/50V)
CTRLB_C3  Package: 0603  [SMD_Capacitor_0603]  (hidden comment: 100n/50V)
CTRLB_C4  Package: 1206  [SMD_Capacitor_1206]  (hidden comment: 2.2u/50V)
CTRLB_C5  Package: 0603  [SMD_Capacitor_0603]  (hidden comment: 100n/50V)
CTRLB_H1  CTRLB_UART  [Connfly_DS1031-04-2]
CTRLB_H2  CTRLB_JTAG  [Connfly_DS1031-08-2]
CTRLB_J1  2 way net tie junction  [2way_LP]  (value not drawn)  (net tie, no BOM)
CTRLB_R1  Package: 0603  [SMD_Resistor_0603]  (hidden comment: 330k)
CTRLB_R2  Package: 0603  [SMD_Resistor_0603]  (hidden comment: 330k)
CTRLB_R3  Package: 0603  [SMD_Resistor_0603]  (hidden comment: 10k/1%)
CTRLB_R4  Package: 0603  [SMD_Resistor_0603]  (hidden comment: 10k/1%)
CTRLB_R5  Package: 0603  [SMD_Resistor_0603]  (hidden comment: 220R/1%)
CTRLB_R6  Package: 0603  [SMD_Resistor_0603]  (hidden comment: 220R/1%)
CTRLB_R7  Package: 0603  [SMD_Resistor_0603]  (hidden comment: 4.7k/1%)
CTRLB_R8  4x10k  [SMD_RESISTOR_ARRAY_YC124]
CTRLB_R9  Package: 0603  [SMD_Resistor_0603]  (hidden comment: 10k/1%)
CTRLB_R10  Package: 0603  [SMD_Resistor_0603]  (hidden comment: 100R/1%)
CTRLB_R11  Package: 0603  [SMD_Resistor_0603]  (hidden comment: 1k/1%)
CTRLB_U1  ATMEGA164PV-10AQ  [TQFP-44]

### Sub-sheets
CTRL-B_Supply = EPS_CTRL_AB_Supply.SchDoc: CTRL_VCC (out), CTRL_AVCC (out), CTRL_AREF (out), 3V3d (in), 3V3a (in)
I2C Repeater = EPS_I2C-Repeater.SchDoc: I2C_Primary (harness I2C), I2C_Secondary (harness I2C), VCC_Secondary (in), VCC_Primary (in)
Temperature-Sensor = EPS_Temperature-Sensor.SchDoc: OUT (out), Vcc (in), GND

### Ports
Battery_CTRLB (harness Battery_CTRLB), CTRLB_Distribution (harness CTRLB_Distribution), CTRLB_SUPP (harness CTRLB_SUPP), DCDC_CTRLB (harness DCDC_CTRLB), I2C_Payload (harness I2C), MPPTX_~{Disable} (out), MPPTY+_~{Disable} (out), MPPTY-_~{Disable} (out)

### Harnesses
I2C: SDA, SCL
DCDC_CTRLB: ~{PowerCycle}, ~{isLowBattery}
Battery_CTRLB: BatteryControl, HeatersControl, PT1000
BatteryController_R: CHRG_LCL_R, CHR_MeasV_R
CHRG_LCL_R: LCL_ON
CTRLB_Distribution: TKred, ANTs
LCL-TK_CTRL: FlagB, LCL_ON, Burn_SAIL, Burn_SADS
LCL-FPF_CTRL: LCL_FlagB, LCL_ON
CTRLB_SUPP: Temperature, WatchDog-Timer

### Nets
CTRLA_3V3d: CTRLB_R3.2
CTRLB_3V3a: CTRLB_R10.2 ; sheet CTRL-B_Supply/3V3a
CTRLB_3V3d: CTRLB_C3.1 CTRLB_C4.1 CTRLB_H2.4 CTRLB_R1.1 CTRLB_R2.1 CTRLB_R7.2 CTRLB_R8.1 CTRLB_R8.2 CTRLB_R8.3 CTRLB_R8.4 CTRLB_U1.5(VCC) CTRLB_U1.17(VCC) CTRLB_U1.38(VCC) ; sheet I2C Repeater/VCC_Secondary, sheet I2C Repeater/VCC_Primary, sheet CTRL-B_Supply/CTRL_VCC, sheet CTRL-B_Supply/3V3d
CTRLB_Vref: CTRLB_R9.2 CTRLB_U1.29(AREF) ; sheet CTRL-B_Supply/CTRL_AREF
DGND: CTRLB_C1.2 CTRLB_C2.2 CTRLB_C3.2 CTRLB_C4.2 CTRLB_H1.2 CTRLB_H1.4 CTRLB_H2.2 CTRLB_H2.8 CTRLB_J1.2 CTRLB_R4.1 CTRLB_U1.6(GND) CTRLB_U1.18(GND) CTRLB_U1.28(GND) CTRLB_U1.39(GND) ; sheet Temperature-Sensor/GND
PGND: CTRLB_C5.2 CTRLB_J1.1
CTRLB_BATC_Heater: CTRLB_U1.12(PD3_(PCINT/TXD1/27/INT1)) ; port Battery_CTRLB.HeatersControl
CTRLB_BATC_PT1000: CTRLB_R11.2 CTRLB_U1.32(PA5_(ADC5/PCINT5))
CTRLB_BATC_RLCL_ON: CTRLB_U1.11(PD2_(PCINT/RXD1/26/INT0)) ; harness CHRG_LCL_R.LCL_ON
CTRLB_BATC_VOLT: CTRLB_U1.36(PA1_(ADC1/PCINT1)) ; harness BatteryController_R.CHR_MeasV_R
CTRLB_BURN_SADS: CTRLB_U1.16(PD7_(PCINT31/OC2A)) ; harness LCL-TK_CTRL.Burn_SADS
CTRLB_BURN_SAIL: CTRLB_U1.15(PD6_(PCINT30/OC2B/ICP)) ; harness LCL-TK_CTRL.Burn_SAIL
CTRLB_HK_SUPP_TEMP: CTRLB_U1.34(PA3_(ADC3/PCINT3)) ; port CTRLB_SUPP.Temperature
CTRLB_HK_TEMP: CTRLB_U1.37(PA0_(ADC0/PCINT0)) ; sheet Temperature-Sensor/OUT
CTRLB_JTAG_~{RESET}: CTRLB_C2.1 CTRLB_H2.6 CTRLB_R7.1 CTRLB_U1.4(~{RESET})
CTRLB_JTAG_TCK: CTRLB_H2.1 CTRLB_R8.8 CTRLB_U1.21(PC2_(PCINT18/TCK))
CTRLB_JTAG_TDI: CTRLB_H2.7 CTRLB_R8.5 CTRLB_U1.24(PC5_(TDI/PCINT21))
CTRLB_JTAG_TDO: CTRLB_H2.3 CTRLB_R8.7 CTRLB_U1.23(PC4_(TDO/PCINT20))
CTRLB_JTAG_TMS: CTRLB_H2.5 CTRLB_R8.6 CTRLB_U1.22(PC3_(PCINT19/TMS))
CTRLB_LCLs_ANTs_FlagB: CTRLB_R2.2 CTRLB_U1.30(PA7_(ADC7/PCINT7)) ; harness LCL-FPF_CTRL.LCL_FlagB
CTRLB_LCLs_ANTs_ON: CTRLB_U1.26(PC7_(TOSC2/PCINT23)) ; harness LCL-FPF_CTRL.LCL_ON
CTRLB_LCLs_TKred_FlagB: CTRLB_R1.2 CTRLB_U1.31(PA6_(ADC6/PCINT6)) ; harness LCL-TK_CTRL.FlagB
CTRLB_LCLs_TKred_ON: CTRLB_U1.25(PC6_(TOSC1/PCINT22)) ; harness LCL-TK_CTRL.LCL_ON
NetCTRL_C3_2_1: CTRLB_U1.27(AVCC) ; sheet CTRL-B_Supply/CTRL_AVCC
NetCTRLB_C1_1: CTRLB_C1.1 CTRLB_R3.1 CTRLB_R4.2 CTRLB_U1.35(PA2_(ADC2/PCINT2))
NetCTRLB_C5_1: CTRLB_C5.1 CTRLB_R9.1 CTRLB_R11.1 ; port Battery_CTRLB.PT1000
NetCTRLB_H1_1: CTRLB_H1.1 CTRLB_R6.1
NetCTRLB_H1_3: CTRLB_H1.3 CTRLB_R5.1
NetCTRLB_R5_2: CTRLB_R5.2 CTRLB_U1.9(PD0_(PCINT24/RXD0))
NetCTRLB_R6_2: CTRLB_R6.2 CTRLB_U1.10(PD1_(PCINT25/TXD0))
NetCTRLB_R10_1: CTRLB_R10.1 ; sheet Temperature-Sensor/Vcc
NetCTRLB_U1_1: CTRLB_U1.1(PB5_(PCINT13/MOSI)) ; port MPPTX_~{Disable}
NetCTRLB_U1_2: CTRLB_U1.2(PB6_(PCINT14/MISO)) ; port MPPTY+_~{Disable}
NetCTRLB_U1_3: CTRLB_U1.3(PB7_(PCINT15/SCK)) ; port MPPTY-_~{Disable}
NetCTRLB_U1_13: CTRLB_U1.13(PD4_(PCINT28/XCK1/OC1B)) ; port DCDC_CTRLB.~{isLowBattery}
NetCTRLB_U1_14: CTRLB_U1.14(PD5_(PCINT29/OC1A)) ; port DCDC_CTRLB.~{PowerCycle}
NetCTRLB_U1_19: CTRLB_U1.19(PC0_(PCINT16/SCL)) ; sheet I2C Repeater/I2C_Secondary.SCL
NetCTRLB_U1_20: CTRLB_U1.20(PC1_(PCINT17/SDA)) ; sheet I2C Repeater/I2C_Secondary.SDA
NetCTRLB_U1_42: CTRLB_U1.42(PB2_(AIN0/INT2/PCINT10)) ; port CTRLB_SUPP.WatchDog-Timer

Not connected (* = marked no-connect by the designer): CTRLB_U1 7(XTAL2)* 8(XTAL1)* 33(PA4_(ADC4/PCINT4))* 40(PB0_(XCK0/T0/PCINT8))* 41(PB1_(T1/CLKO/PCINT9))* 43(PB3_(AIN1/OC0A/PCINT11))* 44(PB4_(~{SS}/OC0B/PCINT12))*

### Buses and harness runs
harness port I2C_Payload = sheet I2C Repeater/I2C_Primary

### Notes on the sheet
- (near CTRLB_R1) 220k
- (near CTRLB_R2) 220k
- 3.3k/0.1%
- Dodać pull-upy
- Title:
- Project:
- Author:
- Model:
- Document Number:
- Checked by:
- Rev:
- Date:
- Approved by:
- Sheet:
- of
- File name:

### Library data of the parts
CTRLB_C1-CTRLB_C3 CTRLB_C5 = Cer_C0603T104K5RALTU: Ceramic Cap Kemet COTS 100n/50V X7R 0603; Manufacturer: Kemet; ManufacturerPartNumber: C0603T104K5RALTU
  CTRLB_C1 CTRLB_C3 CTRLB_C5: Value: 100n/50V
  CTRLB_C2: Value: 10n/50V
CTRLB_C4 = Cer_GCJ31CR71H225KA12L: Ceramic Cap Murata Automotive 2.2u/50V X7R 1206; Manufacturer: Murata; ManufacturerPartNumber: GCJ31CR71H225KA12L; Value: 2.2u/50V
CTRLB_H1 = Header 2X2: Header, 2-Pin, Dual row; LatestRevisionDate: 17-Jul-2002; LatestRevisionNote: Re-released for DXP Platform.; Publisher: Altium Limited
CTRLB_H2 = Header 4X2: Header, 4-Pin, Dual row; LatestRevisionDate: 17-Jul-2002; LatestRevisionNote: Re-released for DXP Platform.; Publisher: Altium Limited
CTRLB_J1 = 2way: ComponentLink1URL: http://www.edatools.cz/addons; ComponentLink1Description: Source; FootprintNote: LP=12mil, MP=40mil, HP=120mil
CTRLB_R1-CTRLB_R7 CTRLB_R9 CTRLB_R11 = CRCW06034K70FKxxxx: 4.7k/1% Vishay CRCW 0603 Resistor. 100mW, 100ppm, 75V.; Manufacturer: Vishay; ManufactuerPartNumber: CRCW06034K70FKxxxx
  CTRLB_R1 CTRLB_R2: Value: 330k
  CTRLB_R3 CTRLB_R4 CTRLB_R9: Value: 10k/1%
  CTRLB_R5 CTRLB_R6: Value: 220R/1%
  CTRLB_R7: Value: 4.7k/1%
  CTRLB_R11: Value: 1k/1%
CTRLB_R8 = YC124-JR-072K2L: RESISTOR ARRAY, 4 x 0402; URL: http://pl.farnell.com/yageo-phycomp/yc124-jr-072k2l/resistor-array-arv341-4-x-0402/dp/9235388
CTRLB_R10 = CRCW06031K00FKxxxx: as TEMP_R5 on sheet EPS_Local-Supply_Channel; Manufacturer: Vishay; ManufacturerPartNumber: CRCW06031K00FKxxxx; Value: 100R/1%
CTRLB_U1 = ATMEGA164PV-10AQ: General-purpose microcontroller; Value: ATMEGA164PV-10AQ

## Sheet EPS_Connectors_PC-104.SchDoc: Connectors / PC-104
size A4; ApprovedBy: (not approved); CheckedBy: (not checked); Author: Piotr Kuligowski; DocumentNumber: PWSat2-xxx-DW-xxx; Revision: 2; SheetNumber: 2; SheetTotal: 51; Model: EM2
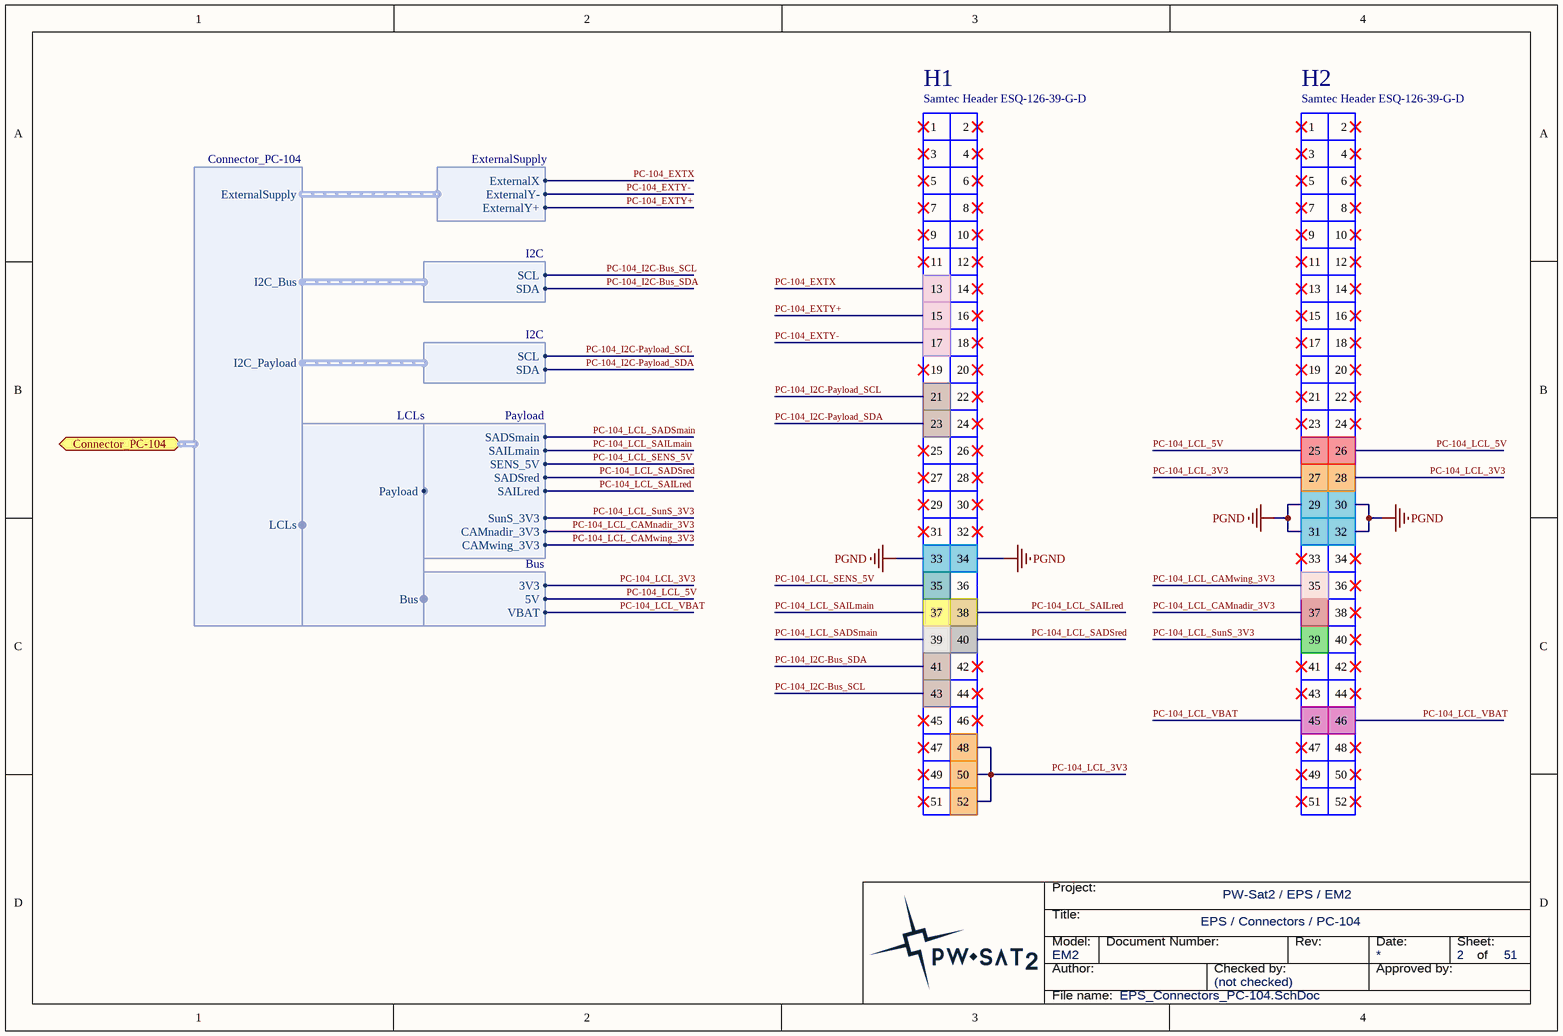
[diagram p30: EPS_Connectors_PC-104.SchDoc]

### Parts
H1  Samtec Header ESQ-126-39-G-D  [Samtec_ESQ-126-39-G-D]
H2  Samtec Header ESQ-126-39-G-D  [Samtec_ESQ-126-39-G-D]

### Ports
Connector_PC-104 (harness Connector_PC-104)

### Harnesses
Connector_PC-104: I2C_Payload, LCLs, I2C_Bus, ExternalSupply
Payload: SADSred, SAILred, SENS_5V, SAILmain, SADSmain, SunS_3V3, CAMnadir_3V3, CAMwing_3V3
I2C: SDA, SCL
LCLs: Payload, Bus
Bus: 3V3, 5V, VBAT
ExternalSupply: ExternalX, ExternalY-, ExternalY+

### Nets
PGND: H1.33 H1.34 H2.29 H2.30 H2.31 H2.32
PC-104_EXTX: H1.13 ; harness ExternalSupply.ExternalX
PC-104_EXTY+: H1.15 ; harness ExternalSupply.ExternalY+
PC-104_EXTY-: H1.17 ; harness ExternalSupply.ExternalY-
PC-104_I2C-Bus_SCL: H1.43 ; harness I2C.SCL
PC-104_I2C-Bus_SDA: H1.41 ; harness I2C.SDA
PC-104_I2C-Payload_SCL: H1.21 ; harness I2C.SCL
PC-104_I2C-Payload_SDA: H1.23 ; harness I2C.SDA
PC-104_LCL_3V3: H1.48 H1.50 H1.52 H2.27 H2.28 ; harness Bus.3V3
PC-104_LCL_5V: H2.25 H2.26 ; harness Bus.5V
PC-104_LCL_CAMnadir_3V3: H2.37 ; harness Payload.CAMnadir_3V3
PC-104_LCL_CAMwing_3V3: H2.35 ; harness Payload.CAMwing_3V3
PC-104_LCL_SADSmain: H1.39 ; harness Payload.SADSmain
PC-104_LCL_SADSred: H1.40 ; harness Payload.SADSred
PC-104_LCL_SAILmain: H1.37 ; harness Payload.SAILmain
PC-104_LCL_SAILred: H1.38 ; harness Payload.SAILred
PC-104_LCL_SENS_5V: H1.35 ; harness Payload.SENS_5V
PC-104_LCL_SunS_3V3: H2.39 ; harness Payload.SunS_3V3
PC-104_LCL_VBAT: H2.45 H2.46 ; harness Bus.VBAT

Not connected (* = marked no-connect by the designer): H1 1* 2* 3* 4* 5* 6* 7* 8* 9* 10* 11* 12* 14* 16* 18* 19* 20* 22* 24* 25* 26* 27* 28* 29* 30* 31* 32* 36 42* 44* 45* 46* 47* 49* 51*; H2 1* 2* 3* 4* 5* 6* 7* 8* 9* 10* 11* 12* 13* 14* 15* 16* 17* 18* 19* 20* 21* 22* 23* 24* 33* 34* 36* 38* 40* 41* 42* 43* 44* 47* 48* 49* 50* 51* 52*

### Notes on the sheet
- Title:
- Project:
- Author:
- Model:
- Document Number:
- Checked by:
- Rev:
- Date:
- Approved by:
- Sheet:
- of
- File name:

### Library data of the parts
H1 H2 = Samtec_ESQ-126-xx-x-D: Samtec ESQ Series Header , 2.54mm pitch, 2x26pin. PC-104 Stack Connector.; HelpUrl: http://suddendocs.samtec.com/catalog_english/esq_th.pdf; Value: Samtec Header ESQ-126-39-G-D

## Sheet EPS_Distribution_LCL-FPF.SchDoc: Distribution / LCL-FPF
size A4; ApprovedBy: (not approved); CheckedBy: (not checked); Author: Piotr Kuligowski; DocumentNumber: PWSat2-xxx-DW-xxx; Revision: 2; SheetNumber: 51; SheetTotal: 51; Model: EM2
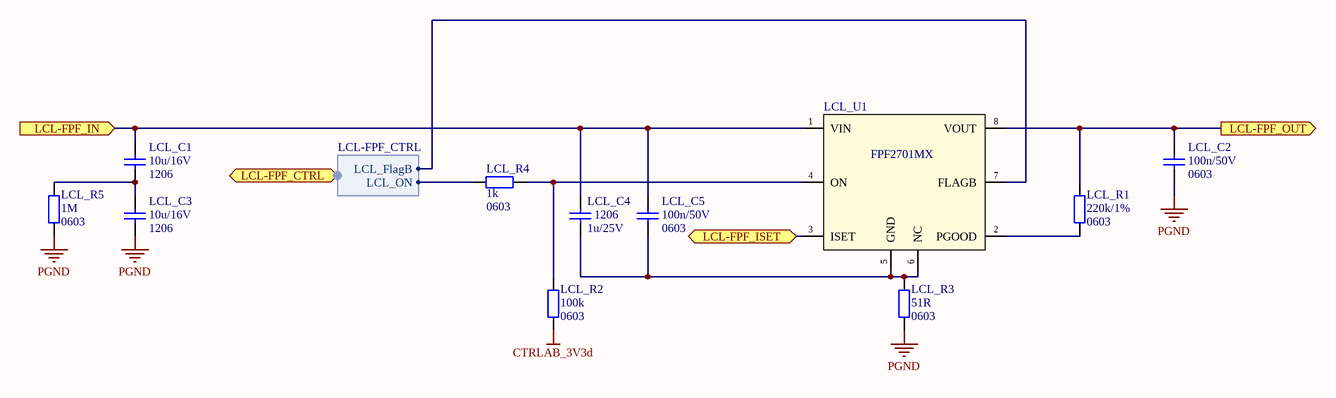
[diagram p31: EPS_Distribution_LCL-FPF.SchDoc]

### Parts
LCL_C1  Packge: 1206  [SMD_Capacitor_1206]  (hidden comment: 10u/16V)
LCL_C2  Package: 0603  [SMD_Capacitor_0603]  (hidden comment: 100n/50V)
LCL_C3  Packge: 1206  [SMD_Capacitor_1206]  (hidden comment: 10u/16V)
LCL_C4  Package: 1206  [SMD_Capacitor_1206]  (hidden comment: 1u/25V)
LCL_C5  Package: 0603  [SMD_Capacitor_0603]  (hidden comment: 100n/50V)
LCL_R1  Package: 0603  [SMD_Resistor_0603]  (hidden comment: 220k/1%)
LCL_R2  Package: 0603  [SMD_Resistor_0603]  (hidden comment: 100k)
LCL_R3  Package: 0603  [SMD_Resistor_0603]  (hidden comment: 51R)
LCL_R4  Package: 0603  [SMD_Resistor_0603]  (hidden comment: 1k)
LCL_R5  Package: 0603  [SMD_Resistor_0603]  (hidden comment: 1M)
LCL_U1  FPF2701MX  [SOIC-8-N]

### Ports
LCL-FPF_CTRL (harness LCL-FPF_CTRL), LCL-FPF_IN (in), LCL-FPF_ISET, LCL-FPF_OUT (out)

### Harnesses
LCL-FPF_CTRL: LCL_FlagB, LCL_ON

### Nets
CTRLAB_3V3d: LCL_R2.1
PGND: LCL_C2.2 LCL_C3.2 LCL_R3.1 LCL_R5.1
NetLCL_C1_1: LCL_C1.1 LCL_C4.1 LCL_C5.1 LCL_U1.1(VIN) ; port LCL-FPF_IN
NetLCL_C1_2: LCL_C1.2 LCL_C3.1 LCL_R5.2
NetLCL_C2_1: LCL_C2.1 LCL_R1.2 LCL_U1.8(VOUT) ; port LCL-FPF_OUT
NetLCL_C4_2: LCL_C4.2 LCL_C5.2 LCL_R3.2 LCL_U1.5(GND) LCL_U1.6(NC)
NetLCL_R1_1: LCL_R1.1 LCL_U1.2(PGOOD)
NetLCL_R2_2: LCL_R2.2 LCL_R4.1 LCL_U1.4(ON)
NetLCL_R4_2: LCL_R4.2 ; port LCL-FPF_CTRL.LCL_ON
NetLCL_U1_3: LCL_U1.3(ISET) ; port LCL-FPF_ISET
NetLCL_U1_7: LCL_U1.7(FLAGB) ; port LCL-FPF_CTRL.LCL_FlagB

### Notes on the sheet
- Title:
- Project:
- Author:
- Model:
- Document Number:
- Checked by:
- Rev:
- Date:
- Approved by:
- Sheet:
- of
- File name:

### Library data of the parts
LCL_C1 LCL_C3 = Cer_C1206T106K4RACTU: Ceramic Cap Kemet COTS 10u/16V X7R 1206; ManufacturerPartNumber: C1206T106K4RACTU; Manufacturer: Kemet; Value: 10u/16V
LCL_C2 LCL_C5 = Cer_C0603T104K5RALTU: Ceramic Cap Kemet COTS 100n/50V X7R 0603; Manufacturer: Kemet; ManufacturerPartNumber: C0603T104K5RALTU; Value: 100n/50V
LCL_C4 = Cer_C1206T105K3RALTU: Ceramic Cap Kemet COTS 1u/25V X7R 1206; ManufacturerPartNumber: C1206T105K3RALTU; Manufacturer: Kemet; Value: 1u/25V
LCL_R1-LCL_R5 = Res
  LCL_R1: Value: 220k/1%
  LCL_R2: Value: 100k
  LCL_R3: Value: 51R
  LCL_R4: Value: 1k
  LCL_R5: Value: 1M
LCL_U1 = FPF2701MX: Adj over-current protection 0.4-2A, Load Switch; Manufacturer: Fairchild Semiconductor; Value: FPF2701MX

## Sheet EPS_Distribution_LCL-TK.SchDoc: Distribution / LCL-TK
size A3; ApprovedBy: (not approved); CheckedBy: (not checked); Author: Piotr Kuligowski; DocumentNumber: PWSat2-xxx-DW-xxx; Revision: 2; SheetNumber: 50; SheetTotal: 51; Model: EM2
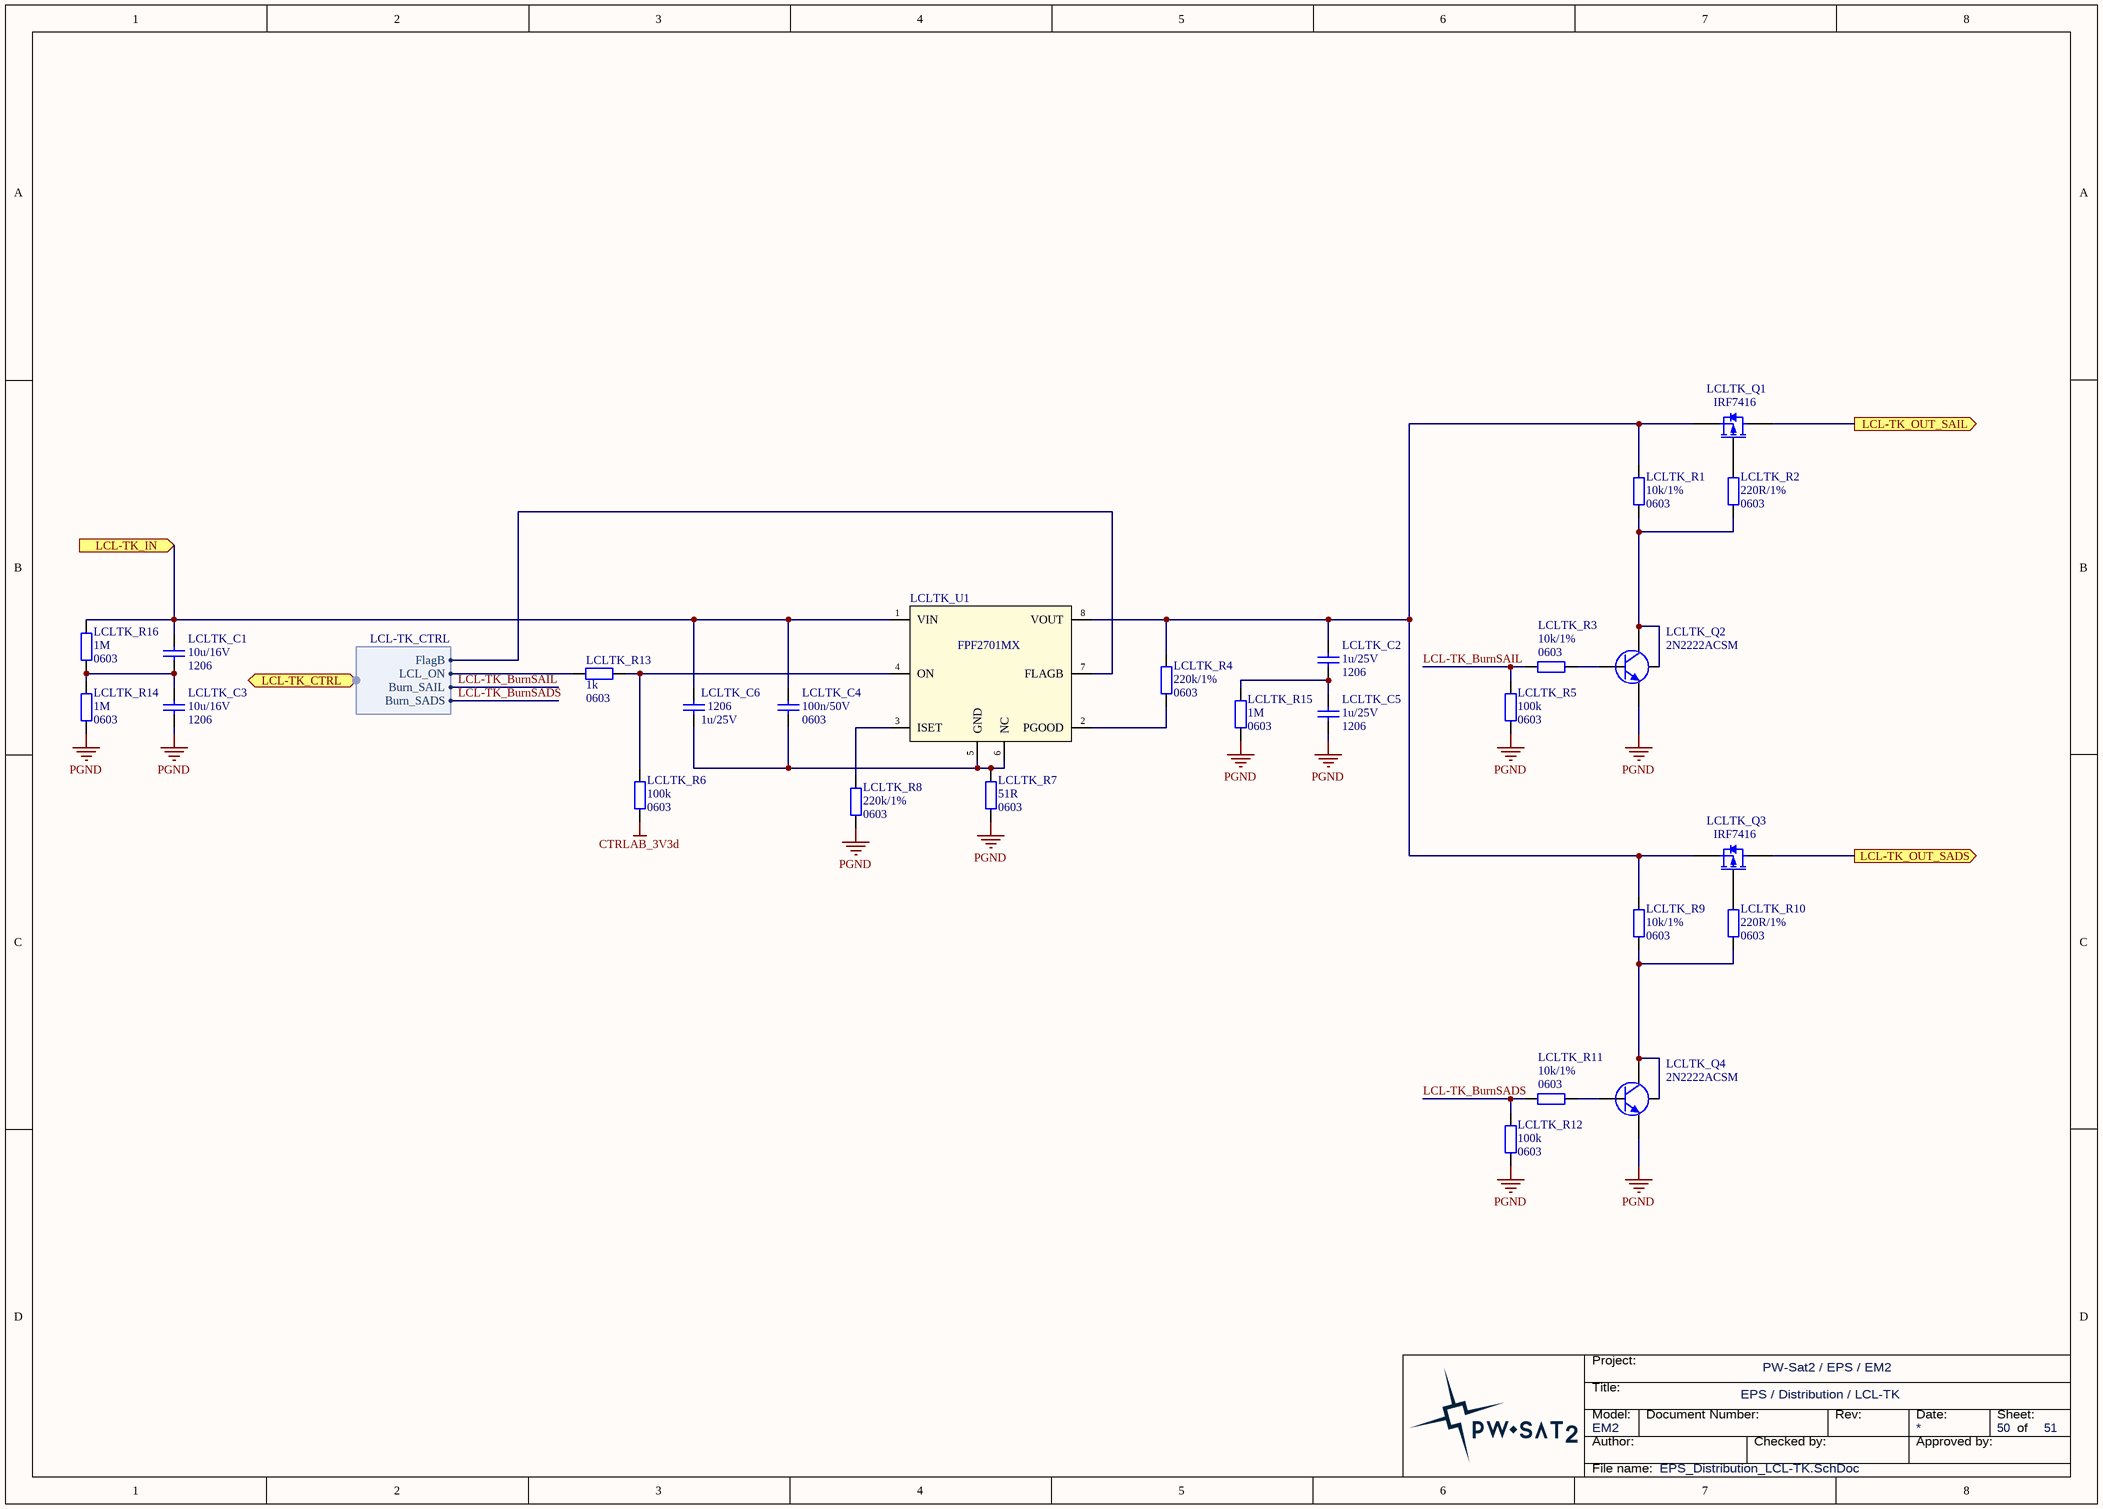
[diagram p32: EPS_Distribution_LCL-TK.SchDoc]

### Parts
LCLTK_C1  Packge: 1206  [SMD_Capacitor_1206]  (hidden comment: 10u/16V)
LCLTK_C2  Package: 1206  [SMD_Capacitor_1206]  (hidden comment: 1u/25V)
LCLTK_C3  Packge: 1206  [SMD_Capacitor_1206]  (hidden comment: 10u/16V)
LCLTK_C4  Package: 0603  [SMD_Capacitor_0603]  (hidden comment: 100n/50V)
LCLTK_C5  Package: 1206  [SMD_Capacitor_1206]  (hidden comment: 1u/25V)
LCLTK_C6  Package: 1206  [SMD_Capacitor_1206]  (hidden comment: 1u/25V)
LCLTK_Q1  IRF7416  [SOIC-8-N_SSSGDDDD]
LCLTK_Q2  2N2222ACSM  [LCC1-4_BEC]
LCLTK_Q3  IRF7416  [SOIC-8-N_SSSGDDDD]
LCLTK_Q4  2N2222ACSM  [LCC1-4_BEC]
LCLTK_R1  Package: 0603  [SMD_Resistor_0603]  (hidden comment: 10k/1%)
LCLTK_R2  Package: 0603  [SMD_Resistor_0603]  (hidden comment: 220R/1%)
LCLTK_R3  Package: 0603  [SMD_Resistor_0603]  (hidden comment: 10k/1%)
LCLTK_R4  Package: 0603  [SMD_Resistor_0603]  (hidden comment: 220k/1%)
LCLTK_R5  Package: 0603  [SMD_Resistor_0603]  (hidden comment: 100k)
LCLTK_R6  Package: 0603  [SMD_Resistor_0603]  (hidden comment: 100k)
LCLTK_R7  Package: 0603  [SMD_Resistor_0603]  (hidden comment: 51R)
LCLTK_R8  Package: 0603  [SMD_Resistor_0603]  (hidden comment: 220k/1%)
LCLTK_R9  Package: 0603  [SMD_Resistor_0603]  (hidden comment: 10k/1%)
LCLTK_R10  Package: 0603  [SMD_Resistor_0603]  (hidden comment: 220R/1%)
LCLTK_R11  Package: 0603  [SMD_Resistor_0603]  (hidden comment: 10k/1%)
LCLTK_R12  Package: 0603  [SMD_Resistor_0603]  (hidden comment: 100k)
LCLTK_R13  Package: 0603  [SMD_Resistor_0603]  (hidden comment: 1k)
LCLTK_R14  Package: 0603  [SMD_Resistor_0603]  (hidden comment: 1M)
LCLTK_R15  Package: 0603  [SMD_Resistor_0603]  (hidden comment: 1M)
LCLTK_R16  Package: 0603  [SMD_Resistor_0603]  (hidden comment: 1M)
LCLTK_U1  FPF2701MX  [SOIC-8-N]

### Ports
LCL-TK_CTRL (harness LCL-TK_CTRL), LCL-TK_IN (in), LCL-TK_OUT_SADS (out), LCL-TK_OUT_SAIL (out)

### Harnesses
LCL-TK_CTRL: FlagB, LCL_ON, Burn_SAIL, Burn_SADS

### Nets
CTRLAB_3V3d: LCLTK_R6.1
PGND: LCLTK_C3.2 LCLTK_C5.2 LCLTK_Q2.E LCLTK_Q4.E LCLTK_R5.1 LCLTK_R7.1 LCLTK_R8.1 LCLTK_R12.1 LCLTK_R14.1 LCLTK_R15.1
LCL-TK_BurnSADS: LCLTK_R11.2 LCLTK_R12.2 ; port LCL-TK_CTRL.Burn_SADS
LCL-TK_BurnSAIL: LCLTK_R3.2 LCLTK_R5.2 ; port LCL-TK_CTRL.Burn_SAIL
NetLCLTK_C1_1: LCLTK_C1.1 LCLTK_C4.1 LCLTK_C6.1 LCLTK_R16.2 LCLTK_U1.1(VIN) ; port LCL-TK_IN
NetLCLTK_C1_2: LCLTK_C1.2 LCLTK_C3.1 LCLTK_R14.2 LCLTK_R16.1
NetLCLTK_C2_1: LCLTK_C2.1 LCLTK_Q1.S LCLTK_Q3.S LCLTK_R1.2 LCLTK_R4.2 LCLTK_R9.2 LCLTK_U1.8(VOUT)
NetLCLTK_C2_2: LCLTK_C2.2 LCLTK_C5.1 LCLTK_R15.2
NetLCLTK_C4_2: LCLTK_C4.2 LCLTK_C6.2 LCLTK_R7.2 LCLTK_U1.5(GND) LCLTK_U1.6(NC)
NetLCLTK_Q1_D: LCLTK_Q1.D ; port LCL-TK_OUT_SAIL
NetLCLTK_Q1_G: LCLTK_Q1.G LCLTK_R2.2
NetLCLTK_Q2_B: LCLTK_Q2.B LCLTK_R3.1
NetLCLTK_Q2_C: LCLTK_Q2.C LCLTK_Q2.Shield LCLTK_R1.1 LCLTK_R2.1
NetLCLTK_Q3_D: LCLTK_Q3.D ; port LCL-TK_OUT_SADS
NetLCLTK_Q3_G: LCLTK_Q3.G LCLTK_R10.2
NetLCLTK_Q4_B: LCLTK_Q4.B LCLTK_R11.1
NetLCLTK_Q4_C: LCLTK_Q4.C LCLTK_Q4.Shield LCLTK_R9.1 LCLTK_R10.1
NetLCLTK_R4_1: LCLTK_R4.1 LCLTK_U1.2(PGOOD)
NetLCLTK_R6_2: LCLTK_R6.2 LCLTK_R13.1 LCLTK_U1.4(ON)
NetLCLTK_R8_2: LCLTK_R8.2 LCLTK_U1.3(ISET)
NetLCLTK_R13_2: LCLTK_R13.2 ; port LCL-TK_CTRL.LCL_ON
NetLCLTK_U1_7: LCLTK_U1.7(FLAGB) ; port LCL-TK_CTRL.FlagB

### Notes on the sheet
- Title:
- Project:
- Author:
- Model:
- Document Number:
- Checked by:
- Rev:
- Date:
- Approved by:
- Sheet:
- of
- File name:

### Library data of the parts
LCLTK_C1 LCLTK_C3 = Cer_C1206T106K4RACTU: Ceramic Cap Kemet COTS 10u/16V X7R 1206; ManufacturerPartNumber: C1206T106K4RACTU; Manufacturer: Kemet; Value: 10u/16V
LCLTK_C2 LCLTK_C5 LCLTK_C6 = Cer_C1206T105K3RALTU: Ceramic Cap Kemet COTS 1u/25V X7R 1206; ManufacturerPartNumber: C1206T105K3RALTU; Manufacturer: Kemet; Value: 1u/25V
LCLTK_C4 = Cer_C0603T104K5RALTU: Ceramic Cap Kemet COTS 100n/50V X7R 0603; Manufacturer: Kemet; ManufacturerPartNumber: C0603T104K5RALTU; Value: 100n/50V
LCLTK_Q1 LCLTK_Q3 = IRF7416: 10A/30V HEXFET Power P-MOSFET.; Manufacturer: International Rectifier; Value: IRF7416
LCLTK_Q2 LCLTK_Q4 = 2N2222ACSM: Silicon Planar Epitaxial NPN Transistor.; Manufacturer: Semelab-TT; Value: 2N2222ACSM
LCLTK_R1-LCLTK_R16 = Res
  LCLTK_R1 LCLTK_R3 LCLTK_R9 LCLTK_R11: Value: 10k/1%
  LCLTK_R2 LCLTK_R10: Value: 220R/1%
  LCLTK_R4 LCLTK_R8: Value: 220k/1%
  LCLTK_R5 LCLTK_R6 LCLTK_R12: Value: 100k
  LCLTK_R7: Value: 51R
  LCLTK_R13: Value: 1k
  LCLTK_R14-LCLTK_R16: Value: 1M
LCLTK_U1 = FPF2701MX: as LCL_U1 on sheet EPS_Distribution_LCL-FPF; Value: FPF2701MX

## Sheet EPS_Distribution_RLCL-FPF.SchDoc: Distribution / RLCL-FPF
size A4; ApprovedBy: (not approved); CheckedBy: (not checked); Author: Piotr Kuligowski; DocumentNumber: PWSat2-xxx-DW-xxx; Revision: 2; SheetNumber: 49; SheetTotal: 51; Model: EM2
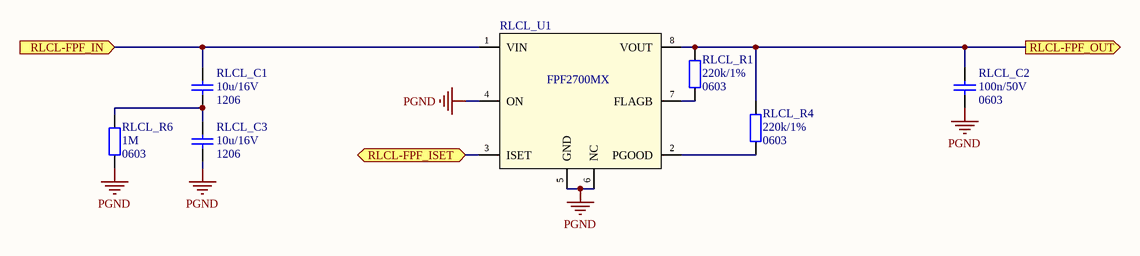
[diagram p33: EPS_Distribution_RLCL-FPF.SchDoc]

### Parts
RLCL_C1  Packge: 1206  [SMD_Capacitor_1206]  (hidden comment: 10u/16V)
RLCL_C2  Package: 0603  [SMD_Capacitor_0603]  (hidden comment: 100n/50V)
RLCL_C3  Packge: 1206  [SMD_Capacitor_1206]  (hidden comment: 10u/16V)
RLCL_R1  Package: 0603  [SMD_Resistor_0603]  (hidden comment: 220k/1%)
RLCL_R4  Package: 0603  [SMD_Resistor_0603]  (hidden comment: 220k/1%)
RLCL_R6  Package: 0603  [SMD_Resistor_0603]  (hidden comment: 1M)
RLCL_U1  FPF2700MX  [SOIC-8-N]

### Ports
RLCL-FPF_IN (in), RLCL-FPF_ISET, RLCL-FPF_OUT (out)

### Nets
PGND: RLCL_C2.2 RLCL_C3.2 RLCL_R6.1 RLCL_U1.4(ON) RLCL_U1.5(GND) RLCL_U1.6(NC)
NetRLCL_C1_1: RLCL_C1.1 RLCL_U1.1(VIN) ; port RLCL-FPF_IN
NetRLCL_C1_2: RLCL_C1.2 RLCL_C3.1 RLCL_R6.2
NetRLCL_C2_1: RLCL_C2.1 RLCL_R1.2 RLCL_R4.2 RLCL_U1.8(VOUT) ; port RLCL-FPF_OUT
NetRLCL_R1_1: RLCL_R1.1 RLCL_U1.7(FLAGB)
NetRLCL_R4_1: RLCL_R4.1 RLCL_U1.2(PGOOD)
NetRLCL_U1_3: RLCL_U1.3(ISET) ; port RLCL-FPF_ISET

### Notes on the sheet
- Title:
- Project:
- Author:
- Model:
- Document Number:
- Checked by:
- Rev:
- Date:
- Approved by:
- Sheet:
- of
- File name:

### Library data of the parts
RLCL_C1 RLCL_C3 = Cer_C1206T106K4RACTU: Ceramic Cap Kemet COTS 10u/16V X7R 1206; ManufacturerPartNumber: C1206T106K4RACTU; Manufacturer: Kemet; Value: 10u/16V
RLCL_C2 = Cer_C0603T104K5RALTU: Ceramic Cap Kemet COTS 100n/50V X7R 0603; Manufacturer: Kemet; ManufacturerPartNumber: C0603T104K5RALTU; Value: 100n/50V
RLCL_R1 RLCL_R4 RLCL_R6 = Res
  RLCL_R1 RLCL_R4: Value: 220k/1%
  RLCL_R6: Value: 1M
RLCL_U1 = FPF2700MX: Adj over-current protection 0.4-2A with auto-reset, Load Switch; Manufacturer: Fairchild Semiconductor; Value: FPF2700MX

## Sheet EPS_Battery_Heaters-Control.SchDoc: Battery / Heaters Control
size A4; ApprovedBy: (not approved); CheckedBy: (not checked); Author: Piotr Kuligowski; DocumentNumber: PWSat2-xxx-DW-xxx; Revision: 2; SheetNumber: 31; SheetTotal: 51; Model: EM2
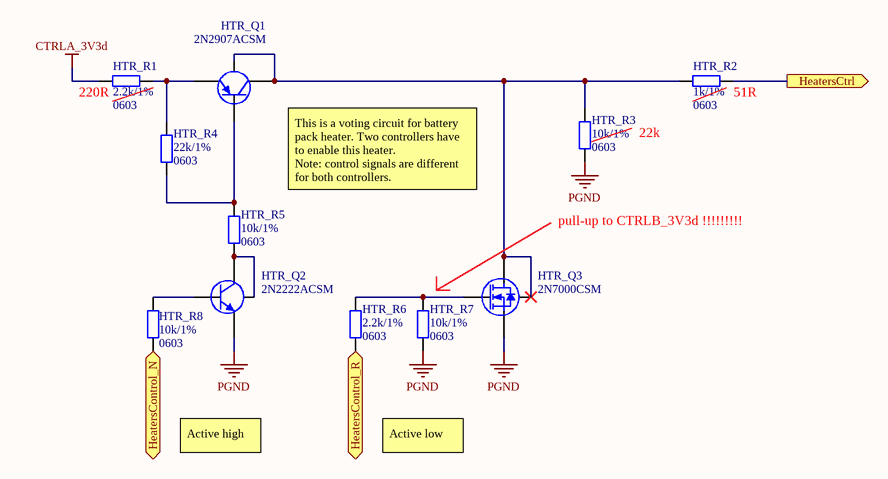
[diagram p34: EPS_Battery_Heaters-Control.SchDoc]

### Parts
HTR_Q1  2N2907ACSM  [LCC1-4_BEC]
HTR_Q2  2N2222ACSM  [LCC1-4_BEC]
HTR_Q3  2N7000CSM  [LCC1-4_GSD]
HTR_R1  Package: 0603  [SMD_Resistor_0603]  (hidden comment: 2.2k/1%)
HTR_R2  Package: 0603  [SMD_Resistor_0603]  (hidden comment: 1k/1%)
HTR_R3  Package: 0603  [SMD_Resistor_0603]  (hidden comment: 10k/1%)
HTR_R4  Package: 0603  [SMD_Resistor_0603]  (hidden comment: 22k/1%)
HTR_R5  Package: 0603  [SMD_Resistor_0603]  (hidden comment: 10k/1%)
HTR_R6  Package: 0603  [SMD_Resistor_0603]  (hidden comment: 2.2k/1%)
HTR_R7  Package: 0603  [SMD_Resistor_0603]  (hidden comment: 10k/1%)
HTR_R8  Package: 0603  [SMD_Resistor_0603]  (hidden comment: 10k/1%)

### Ports
HeatersControl_N (in), HeatersControl_R (in), HeatersCtrl (out)

### Nets
CTRLA_3V3d: HTR_R1.2
PGND: HTR_Q2.E HTR_Q3.S HTR_R3.1 HTR_R7.1
NetHTR_Q1_B: HTR_Q1.B HTR_R4.1 HTR_R5.2
NetHTR_Q1_C: HTR_Q1.C HTR_Q1.Shield HTR_Q3.D HTR_Q3.Shield HTR_R2.2 HTR_R3.2
NetHTR_Q1_E: HTR_Q1.E HTR_R1.1 HTR_R4.2
NetHTR_Q2_B: HTR_Q2.B HTR_R8.1
NetHTR_Q2_C: HTR_Q2.C HTR_Q2.Shield HTR_R5.1
NetHTR_Q3_G: HTR_Q3.G HTR_R6.2 HTR_R7.2
NetHTR_R2_1: HTR_R2.1 ; port HeatersCtrl
NetHTR_R6_1: HTR_R6.1 ; port HeatersControl_R
NetHTR_R8_2: HTR_R8.2 ; port HeatersControl_N

### Notes on the sheet
- (near HTR_R1) 220R
- (near HTR_R2) 51R
- This is a voting circuit for battery pack heater. Two controllers have to enable this heater.
  Note: control signals are different for both controllers.
- 22k
- pull-up to CTRLB_3V3d !!!!!!!!!
- Active high
- Active low
- Title:
- Project:
- Author:
- Model:
- Document Number:
- Checked by:
- Rev:
- Date:
- Approved by:
- Sheet:
- of
- File name:

### Library data of the parts
HTR_Q1 = 2N2907ACSM: Silicon Planar Epitaxial PNP Transistor.; Manufacturer: Semelab-TT; Value: 2N2907ACSM
HTR_Q2 = 2N2222ACSM: as LCLTK_Q2 on sheet EPS_Distribution_LCL-TK; Value: 2N2222ACSM
HTR_Q3 = 2N7000CSM: N-Channel Enhancement Mode MOS Transistor.; Manufacturer: Semelab-TT; Value: 2N7000CSM
HTR_R1-HTR_R8 = Res
  HTR_R1 HTR_R6: Value: 2.2k/1%
  HTR_R2: Value: 1k/1%
  HTR_R3 HTR_R5 HTR_R7 HTR_R8: Value: 10k/1%
  HTR_R4: Value: 22k/1%

## Sheet EPS_Distribution_Measurements.SchDoc: Distribution / Measurements
size A4; ApprovedBy: (not approved); CheckedBy: (not checked); Author: Piotr Kuligowski; DocumentNumber: PWSat2-xxx-DW-xxx; Revision: 2; SheetNumber: 48; SheetTotal: 51; Model: EM2
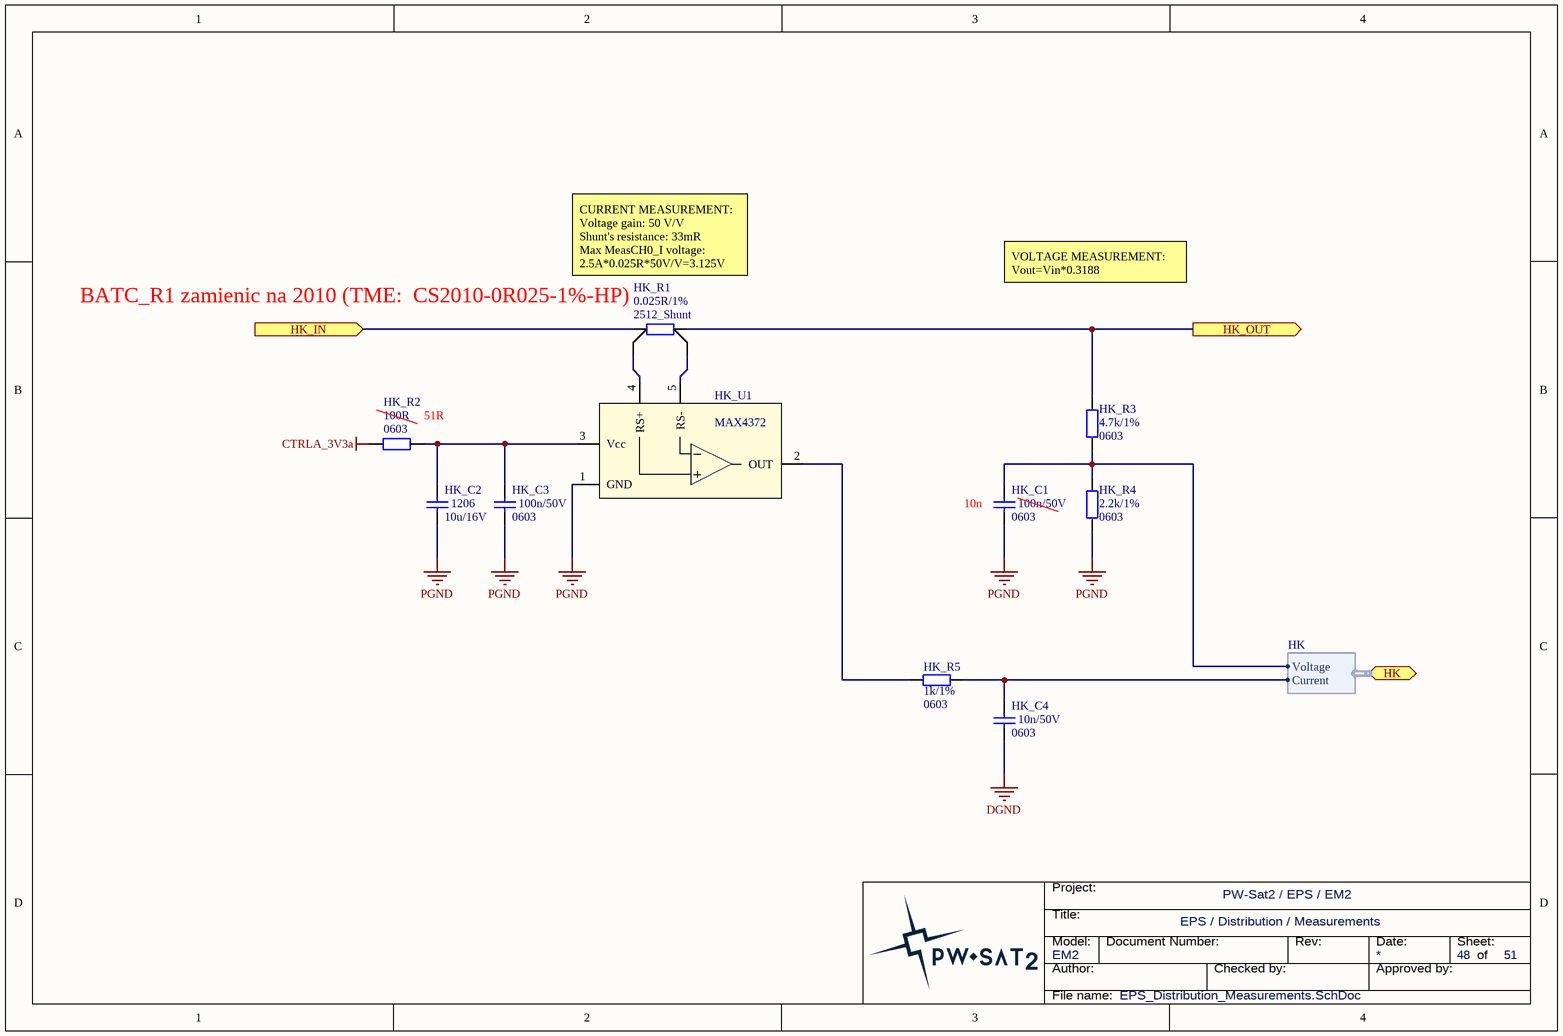
[diagram p35: EPS_Distribution_Measurements.SchDoc]

### Parts
HK_C1  Package: 0603  [SMD_Capacitor_0603]  (hidden comment: 100n/50V)
HK_C2  Packge: 1206  [SMD_Capacitor_1206]  (hidden comment: 10u/16V)
HK_C3  Package: 0603  [SMD_Capacitor_0603]  (hidden comment: 100n/50V)
HK_C4  Package: 0603  [SMD_Capacitor_0603]  (hidden comment: 10n/50V)
HK_R1  Package: 2512_Shunt  [SMD_Resistor-shunt_2512]  (hidden comment: 0.025R/1%)
HK_R2  Package: 0603  [SMD_Resistor_0603]  (hidden comment: 100R)
HK_R3  Package: 0603  [SMD_Resistor_0603]  (hidden comment: 4.7k/1%)
HK_R4  Package: 0603  [SMD_Resistor_0603]  (hidden comment: 2.2k/1%)
HK_R5  Package: 0603  [SMD_Resistor_0603]  (hidden comment: 1k/1%)
HK_U1  MAX4372  [SOT23-5]

### Ports
HK (harness HK), HK_IN (in), HK_OUT (out)

### Harnesses
HK: Voltage, Current

### Nets
CTRLA_3V3a: HK_R2.1
DGND: HK_C4.2
PGND: HK_C1.2 HK_C2.2 HK_C3.2 HK_R4.2 HK_U1.1(GND)
NetHK_C1_1: HK_C1.1 HK_R3.2 HK_R4.1 ; port HK.Voltage
NetHK_C2_1: HK_C2.1 HK_C3.1 HK_R2.2 HK_U1.3(Vcc)
NetHK_C4_1: HK_C4.1 HK_R5.2 ; port HK.Current
NetHK_R1_1: HK_R1.1 ; port HK_IN
NetHK_R1_2: HK_R1.2 HK_U1.4(RS+)
NetHK_R1_3: HK_R1.3 HK_U1.5(RS-)
NetHK_R1_4: HK_R1.4 HK_R3.1 ; port HK_OUT
NetHK_R5_1: HK_R5.1 HK_U1.2(OUT)

### Notes on the sheet
- (near HK_R1) BATC_R1 zamienic na 2010 (TME:  CS2010-0R025-1%-HP)
- CURRENT MEASUREMENT:
  Voltage gain: 50 V/V
  Shunt's resistance: 33mR
  Max MeasCH0_I voltage: 2.5A*0.025R*50V/V=3.125V
- VOLTAGE MEASUREMENT:
  Vout=Vin*0.3188
- (near HK_R2) 51R
- (near HK_C1) 10n
- Title:
- Project:
- Author:
- Model:
- Document Number:
- Checked by:
- Rev:
- Date:
- Approved by:
- Sheet:
- of
- File name:

### Library data of the parts
HK_C1 HK_C3 HK_C4 = Cer_C0603T104K5RALTU: Ceramic Cap Kemet COTS 100n/50V X7R 0603; Manufacturer: Kemet; ManufacturerPartNumber: C0603T104K5RALTU
  HK_C1 HK_C3: Value: 100n/50V
  HK_C4: Value: 10n/50V
HK_C2 = Cer_C1206T106K4RACTU: Ceramic Cap Kemet COTS 10u/16V X7R 1206; ManufacturerPartNumber: C1206T106K4RACTU; Manufacturer: Kemet; Value: 10u/16V
HK_R1 = LR2512-R033FW: 33mR ,1%, 2W, shunt resistor, TE Connectivity.; ManufacturerPartNumber: LR2512-R033FW; Manufacturer: TE Connectivity; Power Rating: 2W; Value: 0.025R/1%
HK_R2-HK_R5 = Res
  HK_R2: Value: 100R
  HK_R3: Value: 4.7k/1%
  HK_R4: Value: 2.2k/1%
  HK_R5: Value: 1k/1%
HK_U1 = MAX4372: High-Side Current-Sense Amplifier with Voltage Output; Manufacturer: Maxim Integrated Products; Value: MAX4372